# Altium project ZYNQ-HS-DEV.PrjPcb (part 3 of 4)

## Sheet ZHSD-HDMI.SchDoc
size A3; DrawnBy: UGUR KELES; DocumentNumber: 15; SheetNumber: 15; SheetTotal: 17; Size: A3
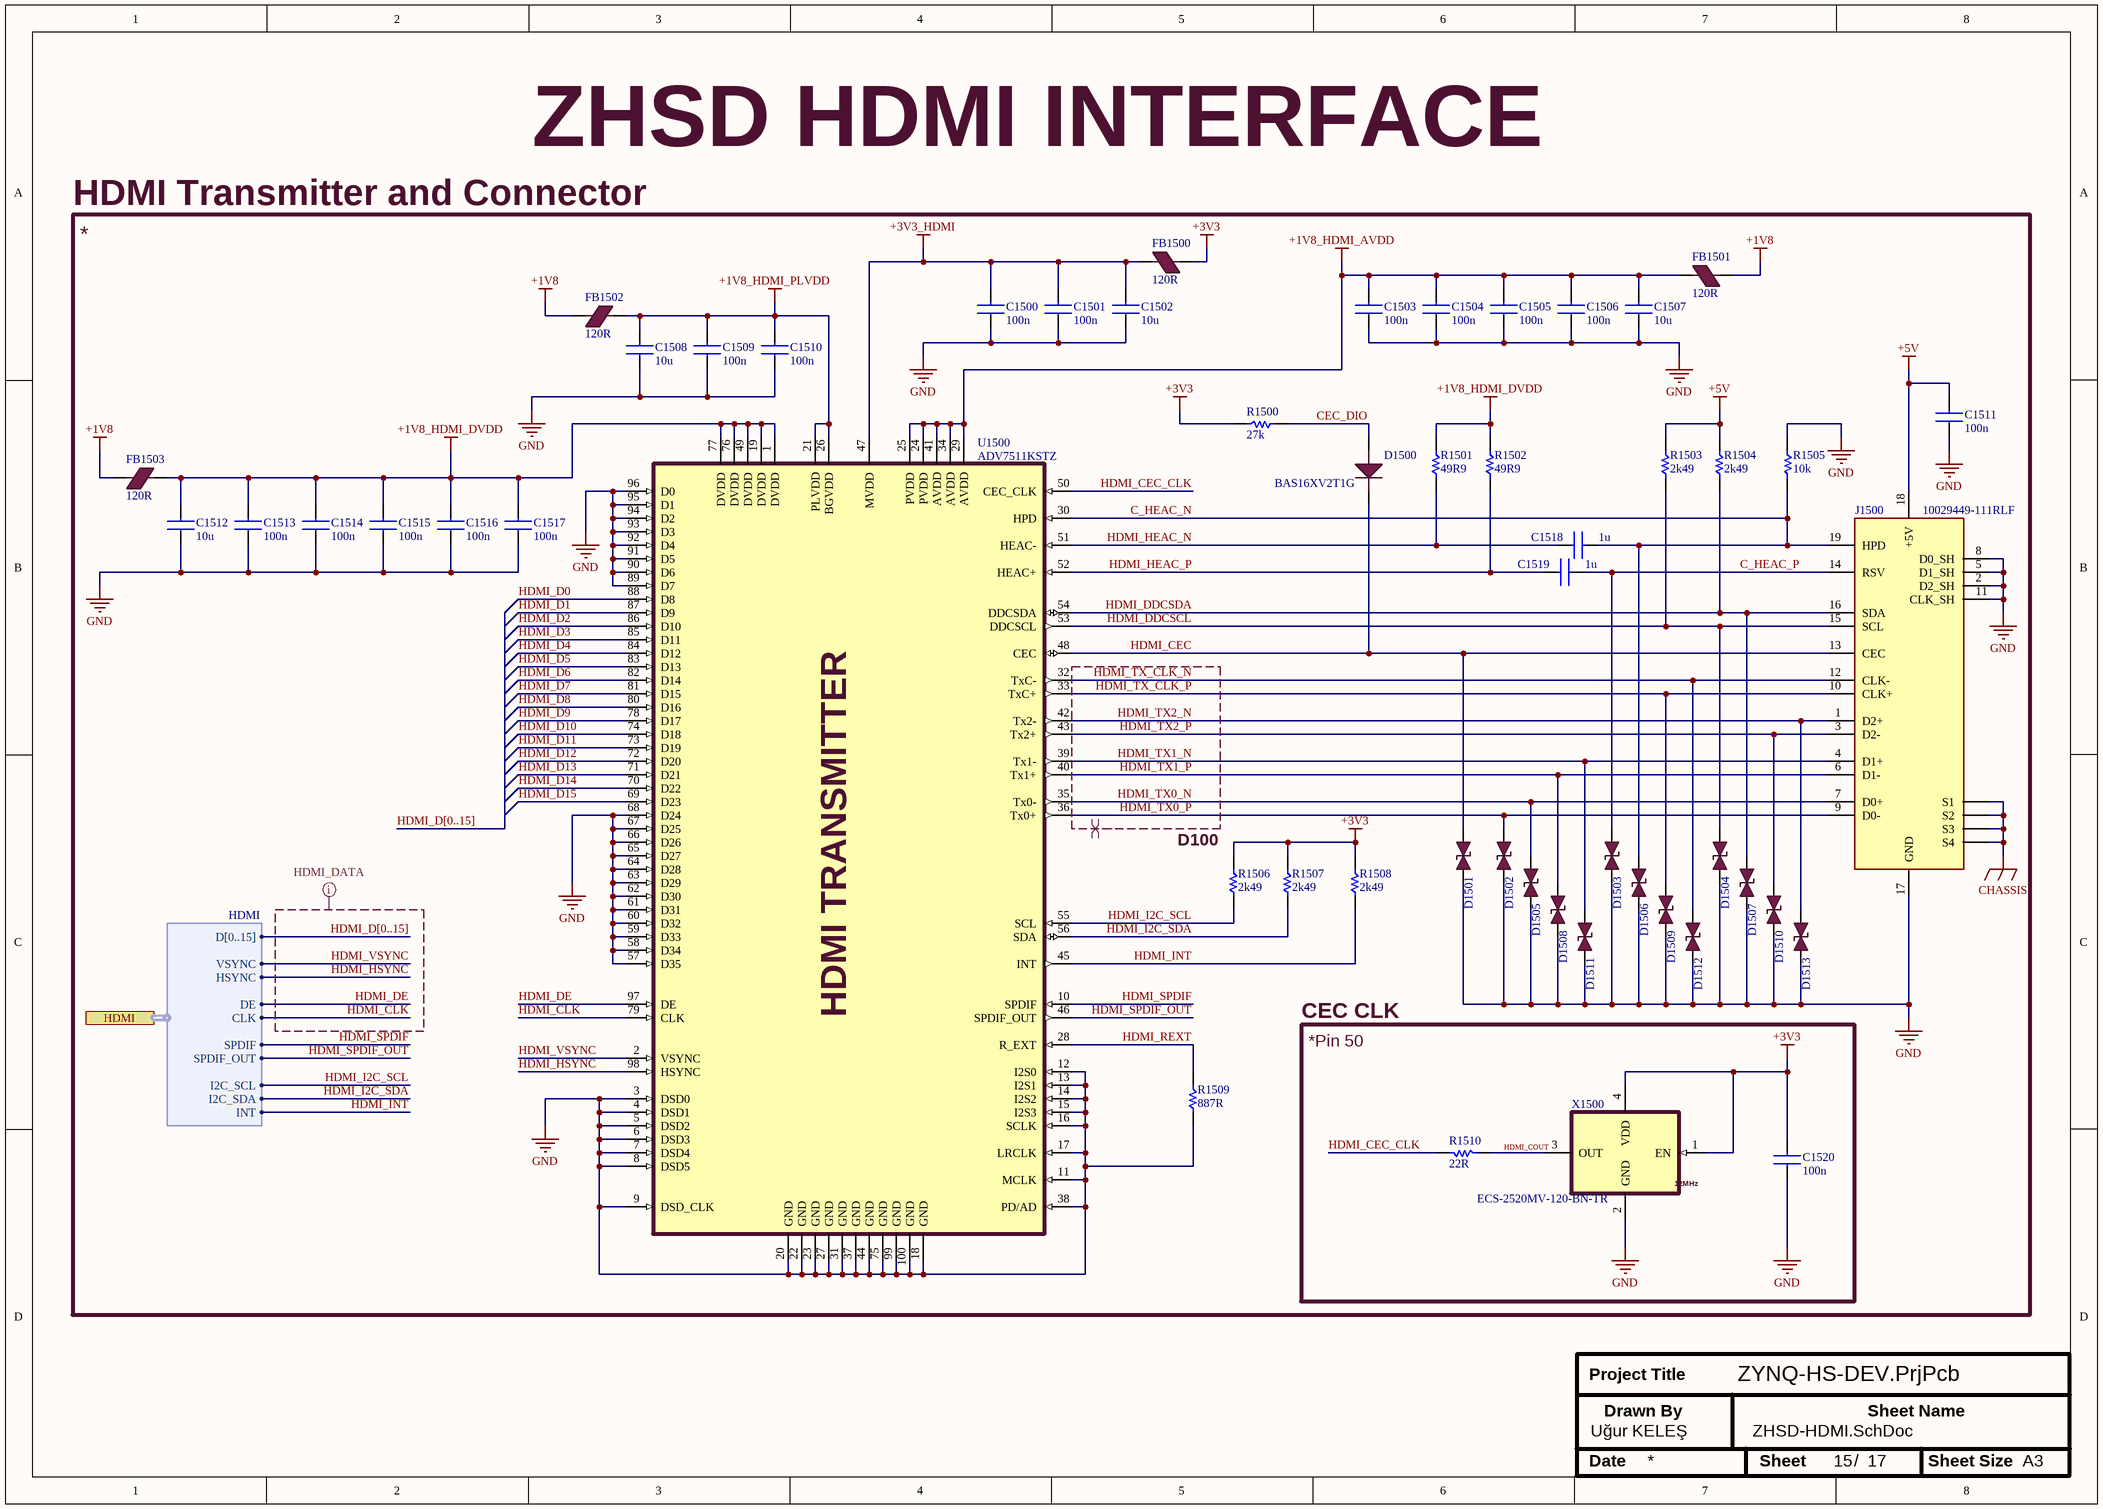
[diagram p11: ZHSD-HDMI.SchDoc]

### Parts
C1500  100n  [0603CAPC1608X09N]
C1501  100n  [0603CAPC1608X09N]
C1502  10u  [0603CAPC1608X09N]
C1503  100n  [0603CAPC1608X09N]
C1504  100n  [0603CAPC1608X09N]
C1505  100n  [0603CAPC1608X09N]
C1506  100n  [0603CAPC1608X09N]
C1507  10u  [0603CAPC1608X09N]
C1508  10u  [0603CAPC1608X09N]
C1509  100n  [0603CAPC1608X09N]
C1510  100n  [0603CAPC1608X09N]
C1511  100n  [0603CAPC1608X09N]
C1512  10u  [0603CAPC1608X09N]
C1513  100n  [0603CAPC1608X09N]
C1514  100n  [0603CAPC1608X09N]
C1515  100n  [0603CAPC1608X09N]
C1516  100n  [0603CAPC1608X09N]
C1517  100n  [0603CAPC1608X09N]
C1518  1u  [0603CAPC1608X09N]
C1519  1u  [0603CAPC1608X09N]
C1520  100n  [0603CAPC1608X09N]
D1500  BAS16XV2T1G  [SODFL160X50-2N]
D1501  B72590D0050H160  [0402DIOC1005X06N]  (value not drawn)
D1502  B72590D0050H160  [0402DIOC1005X06N]  (value not drawn)
D1503  B72590D0050H160  [0402DIOC1005X06N]  (value not drawn)
D1504  B72590D0050H160  [0402DIOC1005X06N]  (value not drawn)
D1505  B72590D0050H160  [0402DIOC1005X06N]  (value not drawn)
D1506  B72590D0050H160  [0402DIOC1005X06N]  (value not drawn)
D1507  B72590D0050H160  [0402DIOC1005X06N]  (value not drawn)
D1508  B72590D0050H160  [0402DIOC1005X06N]  (value not drawn)
D1509  B72590D0050H160  [0402DIOC1005X06N]  (value not drawn)
D1510  B72590D0050H160  [0402DIOC1005X06N]  (value not drawn)
D1511  B72590D0050H160  [0402DIOC1005X06N]  (value not drawn)
D1512  B72590D0050H160  [0402DIOC1005X06N]  (value not drawn)
D1513  B72590D0050H160  [0402DIOC1005X06N]  (value not drawn)
FB1500  120R  [0603INDC1608X08N]
FB1501  120R  [0603INDC1608X08N]
FB1502  120R  [0603INDC1608X08N]
FB1503  120R  [0603INDC1608X08N]
J1500  10029449-111RLF  [AMPHENOL_10029449-111RLF]
R1500  27k  [0402RESC1005X04N]
R1501  49R9  [0402RESC1005X04N]
R1502  49R9  [0402RESC1005X04N]
R1503  2k49  [0402RESC1005X04N]
R1504  2k49  [0402RESC1005X04N]
R1505  10k  [0603RESC1608X05N]
R1506  2k49  [0402RESC1005X04N]
R1507  2k49  [0402RESC1005X04N]
R1508  2k49  [0402RESC1005X04N]
R1509  887R  [0603RESC1608X05N]
R1510  22R  [0603RESC1608X05N]
U1500  ADV7511KSTZ  [LQFP50P1600X1600X160-100N]
X1500  ECS-2520MV-120-BN-TR  [XTAL_2520]

### Blocks framed on the sheet
HDMI Transmitter and Connector: C1500-C1519 D1500-D1513 FB1500-FB1503 J1500 R1500-R1509 U1500
CEC CLK: C1520 R1510 X1500

### Ports
HDMI (harness HDMI, see ZHSD-Block[4000,1700], ZHSD-ZYNQ-PL[3900,2700])

### Harnesses
HDMI: SPDIF, SPDIF_OUT, VSYNC, HSYNC, DE, CLK, INT, I2C_SCL, I2C_SDA, D[0..15]

### Nets
+1V8: FB1501.1 FB1502.1 FB1503.1
+1V8_HDMI_AVDD: C1503.2 C1504.2 C1505.2 C1506.2 C1507.2 FB1501.2 U1500.24(PVDD) U1500.25(PVDD) U1500.29(AVDD) U1500.34(AVDD) U1500.41(AVDD)
+1V8_HDMI_DVDD: C1512.2 C1513.2 C1514.2 C1515.2 C1516.2 C1517.2 FB1503.2 R1501.2 R1502.2 U1500.1(DVDD) U1500.19(DVDD) U1500.49(DVDD) U1500.76(DVDD) U1500.77(DVDD)
+1V8_HDMI_PLVDD: C1508.2 C1509.2 C1510.2 FB1502.2 U1500.21(PLVDD) U1500.26(BGVDD)
+3V3: C1520.2 FB1500.1 R1500.2 R1506.2 R1507.2 R1508.2 X1500.1(EN) X1500.4(VDD)
+3V3_HDMI: C1500.2 C1501.2 C1502.2 FB1500.2 U1500.47(MVDD)
+5V: C1511.2 J1500.18(+5V) R1503.2 R1504.2
CHASSIS: J1500.S1 J1500.S2 J1500.S3 J1500.S4
GND: C1500.1 C1501.1 C1502.1 C1503.1 C1504.1 C1505.1 C1506.1 C1507.1 C1508.1 C1509.1 C1510.1 C1511.1 C1512.1 C1513.1 C1514.1 C1515.1 C1516.1 C1517.1 C1520.1 D1501.1 D1502.1 D1503.1 D1504.1 D1505.1 D1506.1 D1507.1 D1508.1 D1509.1 D1510.1 D1511.1 D1512.1 D1513.1 J1500.2(D2_SH) J1500.5(D1_SH) J1500.8(D0_SH) J1500.11(CLK_SH) J1500.17(GND) R1505.1 R1509.1 U1500.3(DSD0) U1500.4(DSD1) U1500.5(DSD2) U1500.6(DSD3) U1500.7(DSD4) U1500.8(DSD5) U1500.9(DSD_CLK) U1500.11(MCLK) U1500.12(I2S0) U1500.13(I2S1) U1500.14(I2S2) U1500.15(I2S3) U1500.16(SCLK) U1500.17(LRCLK) U1500.18(GND) U1500.20(GND) U1500.22(GND) U1500.23(GND) U1500.27(GND) U1500.31(GND) U1500.37(GND) U1500.38(PD/AD) U1500.44(GND) U1500.57(D35) U1500.58(D34) U1500.59(D33) U1500.60(D32) U1500.61(D31) U1500.62(D30) U1500.63(D29) U1500.64(D28) U1500.65(D27) U1500.66(D26) U1500.67(D25) U1500.68(D24) U1500.75(GND) U1500.89(D7) U1500.90(D6) U1500.91(D5) U1500.92(D4) U1500.93(D3) U1500.94(D2) U1500.95(D1) U1500.96(D0) U1500.99(GND) U1500.100(GND) X1500.2(GND)
C_HEAC_N: C1518.2 D1506.2 J1500.19(HPD) R1505.2 U1500.30(HPD)
C_HEAC_P: C1519.2 D1503.2 J1500.14(RSV)
CEC_DIO: D1500.A R1500.1
HDMI_CEC: D1500.C D1501.2 J1500.13(CEC) U1500.48(CEC)
HDMI_CEC_CLK: R1510.1 U1500.50(CEC_CLK)
HDMI_CLK: U1500.79(CLK) ; port HDMI.CLK
HDMI_COUT: R1510.2 X1500.3(OUT)
HDMI_D0: U1500.88(D8)
HDMI_D1: U1500.87(D9)
HDMI_D2: U1500.86(D10)
HDMI_D3: U1500.85(D11)
HDMI_D4: U1500.84(D12)
HDMI_D5: U1500.83(D13)
HDMI_D6: U1500.82(D14)
HDMI_D7: U1500.81(D15)
HDMI_D8: U1500.80(D16)
HDMI_D9: U1500.78(D17)
HDMI_D10: U1500.74(D18)
HDMI_D11: U1500.73(D19)
HDMI_D12: U1500.72(D20)
HDMI_D13: U1500.71(D21)
HDMI_D14: U1500.70(D22)
HDMI_D15: U1500.69(D23)
HDMI_DDCSCL: D1504.2 J1500.15(SCL) R1503.1 U1500.53(DDCSCL)
HDMI_DDCSDA: D1507.2 J1500.16(SDA) R1504.1 U1500.54(DDCSDA)
HDMI_DE: U1500.97(DE) ; port HDMI.DE
HDMI_HEAC_N: C1518.1 R1501.1 U1500.51(HEAC-)
HDMI_HEAC_P: C1519.1 R1502.1 U1500.52(HEAC+)
HDMI_HSYNC: U1500.98(HSYNC) ; port HDMI.HSYNC
HDMI_I2C_SCL: R1506.1 U1500.55(SCL) ; port HDMI.I2C_SCL
HDMI_I2C_SDA: R1507.1 U1500.56(SDA) ; port HDMI.I2C_SDA
HDMI_INT: R1508.1 U1500.45(INT) ; port HDMI.INT
HDMI_REXT: R1509.2 U1500.28(R_EXT)
HDMI_SPDIF: U1500.10(SPDIF) ; port HDMI.SPDIF
HDMI_SPDIF_OUT: U1500.46(SPDIF_OUT) ; port HDMI.SPDIF_OUT
HDMI_TX0_N: D1505.2 J1500.7(D0+) U1500.35(Tx0-)
HDMI_TX0_P: D1502.2 J1500.9(D0-) U1500.36(Tx0+)
HDMI_TX1_N: D1511.2 J1500.4(D1+) U1500.39(Tx1-)
HDMI_TX1_P: D1508.2 J1500.6(D1-) U1500.40(Tx1+)
HDMI_TX2_N: D1513.2 J1500.1(D2+) U1500.42(Tx2-)
HDMI_TX2_P: D1510.2 J1500.3(D2-) U1500.43(Tx2+)
HDMI_TX_CLK_N: D1512.2 J1500.12(CLK-) U1500.32(TxC-)
HDMI_TX_CLK_P: D1509.2 J1500.10(CLK+) U1500.33(TxC+)
HDMI_VSYNC: U1500.2(VSYNC) ; port HDMI.VSYNC

### Buses and harness runs
bus HDMI_D[0..15]

### Layout directives
differential pair; differential pair class HDMI_DIFF; rule Differential Pairs Routing [Pref Gap = 10mil    Min Gap  = 5mil    Max Gap  = 10milPref Width = 3.937mil    Min Width  = 3.543mil    Max Width  = 3.937mil]: HDMI_TX0_N, HDMI_TX0_P, HDMI_TX1_N, HDMI_TX1_P, HDMI_TX2_N, HDMI_TX2_P, HDMI_TX_CLK_N, HDMI_TX_CLK_P
net class HDMI_DATA; rule Matched Net Lengths [Delay Tolerance = 10ps]: HDMI_CLK, HDMI_D[0..15], HDMI_DE, HDMI_HSYNC, HDMI_VSYNC

### Notes on the sheet
- ZHSD HDMI INTERFACE
- *
- (near R1506) D100
- *Pin 50
- Project Title
- Uğur KELEŞ
- Drawn By
- Sheet Name
- Date
- Sheet
- /
- Sheet Size
- A3
- (in symbol ADV7511KSTZ) HDMI TRANSMITTER
- (in symbol ECS-2520MV-120-BN-TR) 12MHz

### Library data of the parts
C1500 C1501 C1503-C1506 C1509-C1511 C1513-C1517 = GRM155R71C104KA88J: CAP CER 0.1UF 16V X7R 0402 (1005) ±10%; Manufacturer: Murata Electronics; Value: 0.1 µF; ComponentLink1Description: Datasheet; ComponentLink1URL: https://search.murata.co.jp/Ceramy/image/img/A01X/G101/ENG/GRM155R71C104KA88-01.pdf; MPN: GRM155R71C104KA88J; Package: 0402; Tolerance: ±10%; Voltage: 16V
C1502 C1507 C1508 C1512 = GRM188Z71A106MA73D: CAP CER 10UF 10V X7R 0603 (1608) ±20%; Manufacturer: Murata Electronics; Value: 10 µF; ComponentLink1Description: Datasheet; ComponentLink1URL: https://search.murata.co.jp/Ceramy/image/img/A01X/G101/ENG/GRM188Z71A106MA73-01A.pdf; MPN: GRM188Z71A106MA73D; Package: 0603; Tolerance: ±20%; Voltage: 10V
C1518 C1519 = GRM188R61E105KA12D: CAP CER 1UF 25V X5R 0603 (1608) ±10%; Manufacturer: Murata Power Solutions Inc.; Value: 1 µF; ComponentLink1Description: Datasheet; ComponentLink1URL: https://search.murata.co.jp/Ceramy/image/img/A01X/G101/ENG/GRM188R61E105KA12-01.pdf; MPN: GRM188R61E105KA12D; Package: 0603; Tolerance: ±10%; Voltage: 25V
C1520 = C0603C104K5RACTU: CAP CER 0.1UF 50V X7R 0603 (1608) ±10%; Manufacturer: KEMET; Value: 0.1 µF; ComponentLink1Description: Datasheet; ComponentLink1URL: https://yageogroup.com/content/datasheet/asset/file/KEM_C1002_X7R_SMD; MPN: C0603C104K5RACTU; Package: 0603; Tolerance: ±10%; Voltage: 50V
D1500 = BAS16XV2T1G: DIODE STANDARD 100V 200MA SOD523; Manufacturer: onsemi; ComponentLink1Description: Datasheet; ComponentLink1URL: https://www.onsemi.com/pdf/datasheet/bas16xv2t1-d.pdf; MPN: BAS16XV2T1G; Package: SOD-523
D1501-D1513 = B72590D0050H160: Varistor 1 Circuit Surface Mount, MLCV 0402 (1005 Metric); Manufacturer: EPCOS - TDK Electronics; ComponentLink1Description: Datasheet; ComponentLink1URL: https://www.tdk-electronics.tdk.com/inf/75/ds/High_speed_series.pdf?ref_disty=digikey; MPN: B72590D0050H160; Package: 0402
FB1500-FB1503 = BLM18SG121TN1D: FERRITE BEAD 120 OHM 0603 (1608) 3A 25mOhm; Manufacturer: Murata Electronics; Impedance @ Frequency: 120 Ohms @ 100 MHz; ComponentLink1Description: Datasheet; ComponentLink1URL: https://pim.murata.com/asset/pim4/ferriteBeadInductortypefilter/ENFA0003_PDF_FERRITEBEADINDUCTORTYPEFILTER?lastModifiedDatetime=20250707190934; ComponentLink2Description: Website; ComponentLink2URL: https://pim.murata.com/en-global/pim/details/?partNum=BLM18SG121TN1%23; Current Rating (Max): 3A; DC Resistance (DCR) (Max): 25mOhm; MPN: BLM18SG121TN1D; Package: 0603
J1500 = 10029449-111RLF: CONN RCPT 1.4 HDMI 19POS SMD R/A; Manufacturer: Amphenol ICC (FCI); ComponentLink1Description: Datasheet; ComponentLink1URL: https://cdn.amphenol-cs.com/media/wysiwyg/files/documentation/datasheet/inputoutput/io_hdmi_receptacles.pdf; ComponentLink2Description: Drawing; ComponentLink2URL: https://cdn.amphenol-cs.com/media/wysiwyg/files/drawing/10029449.pdf; ComponentLink3Description: Product Specification; ComponentLink3URL: https://cdn.amphenol-cs.com/media/wysiwyg/files/documentation/gs-12-309.pdf; MPN: 10029449-111RLF
R1500 = RC0402FR-0727KL: RES 27K OHM 1% 1/16W 0402 (1005); Manufacturer: YAGEO; Value: 27 kOhms; Voltage: 50V; ComponentLink1Description: Datasheet; ComponentLink1URL: https://yageogroup.com/content/datasheet/asset/file/PYU-RC_GROUP_51_ROHS_L; MPN: RC0402FR-0727KL; Tolerance: ±1%; Package: 0402
R1501 R1502 = RC0402FR-0749R9L: RES 49.9 OHM 1% 1/16W 0402 (1005); Manufacturer: YAGEO; Value: 49.9 Ohms; Voltage: 50V; ComponentLink1Description: Datasheet; ComponentLink1URL: https://yageogroup.com/content/datasheet/asset/file/PYU-RC_GROUP_51_ROHS_L; MPN: RC0402FR-0749R9L; Tolerance: ±1%; Package: 0402
R1503 R1504 R1506-R1508 = RC0402FR-132K49L: RES 2.49K OHM 1% 1/16W 0402 (1005); Manufacturer: YAGEO; Value: 2.49 kOhms; Voltage: 50V; ComponentLink1Description: Datasheet; ComponentLink1URL: https://yageogroup.com/content/datasheet/asset/file/PYU-RC_GROUP_51_ROHS_L; MPN: RC0402FR-132K49L; Tolerance: ±1%; Package: 0402
R1505 = RC0603FR-0710KL: as R1403-R1406 on sheet ZHSD-ZYNQ-PL; ComponentLink1Description: Datasheet; ComponentLink1URL: https://yageogroup.com/content/datasheet/asset/file/PYU-RC_GROUP_51_ROHS_L; MPN: RC0603FR-0710KL; Tolerance: ±1%; Package: 0603
R1509 = RC0603FR-07887RL: RES 887 OHM 1% 1/10W 0603 (1608); Manufacturer: YAGEO; Value: 887 Ohms; Voltage: 75V; ComponentLink1Description: Datasheet; ComponentLink1URL: https://yageogroup.com/content/datasheet/asset/file/PYU-RC_GROUP_51_ROHS_L; MPN: RC0603FR-07887RL; Tolerance: ±1%; Package: 0603
R1510 = RC0603FR-0722RL: RES 22 OHM 1% 1/10W 0603 (1608); Manufacturer: YAGEO; Value: 22 Ohms; Voltage: 75V; ComponentLink1Description: Datasheet; ComponentLink1URL: https://yageogroup.com/content/datasheet/asset/file/PYU-RC_GROUP_51_ROHS_L; MPN: RC0603FR-0722RL; Tolerance: ±1%; Package: 0603
U1500 = ADV7511KSTZ: 225 MHz, High Performance HDMI® Transmitter with ARC; Manufacturer: Analog Devices Inc./Maxim Integrated; ComponentLink1Description: Datasheet; ComponentLink1URL: https://www.analog.com/media/en/technical-documentation/data-sheets/ADV7511.pdf; ComponentLink2Description: Hardware User's Guide; ComponentLink2URL: https://www.analog.com/media/en/technical-documentation/user-guides/ADV7511_Hardware_Users_Guide.pdf; ComponentLink3Description: HDMI-Enabled Designs Using the ADV7511; ComponentLink3URL: https://www.analog.com/media/en/technical-documentation/evaluation-documentation/hdmi-enabled_designs_using_adv7511.pdf; ComponentLink4Description: Design Support Files; ComponentLink4URL: https://ez.analog.com/video/w/documents/794/adv7511-design-support-files; MPN: ADV7511KSTZ
X1500 = ECS-2520MV-120-BN-TR: XTAL OSC XO 12.0000MHZ CMOS SMD; Manufacturer: ECS Inc.; ComponentLink1Description: Datasheet; ComponentLink1URL: https://ecsxtal.com/store/pdf/ECS-2520MV.pdf; MPN: ECS-2520MV-120-BN-TR

## Sheet ZHSD-MIPI-CSI2.SchDoc
size A4; DocumentNumber: 16; SheetNumber: 16; SheetTotal: 17; Size: A4
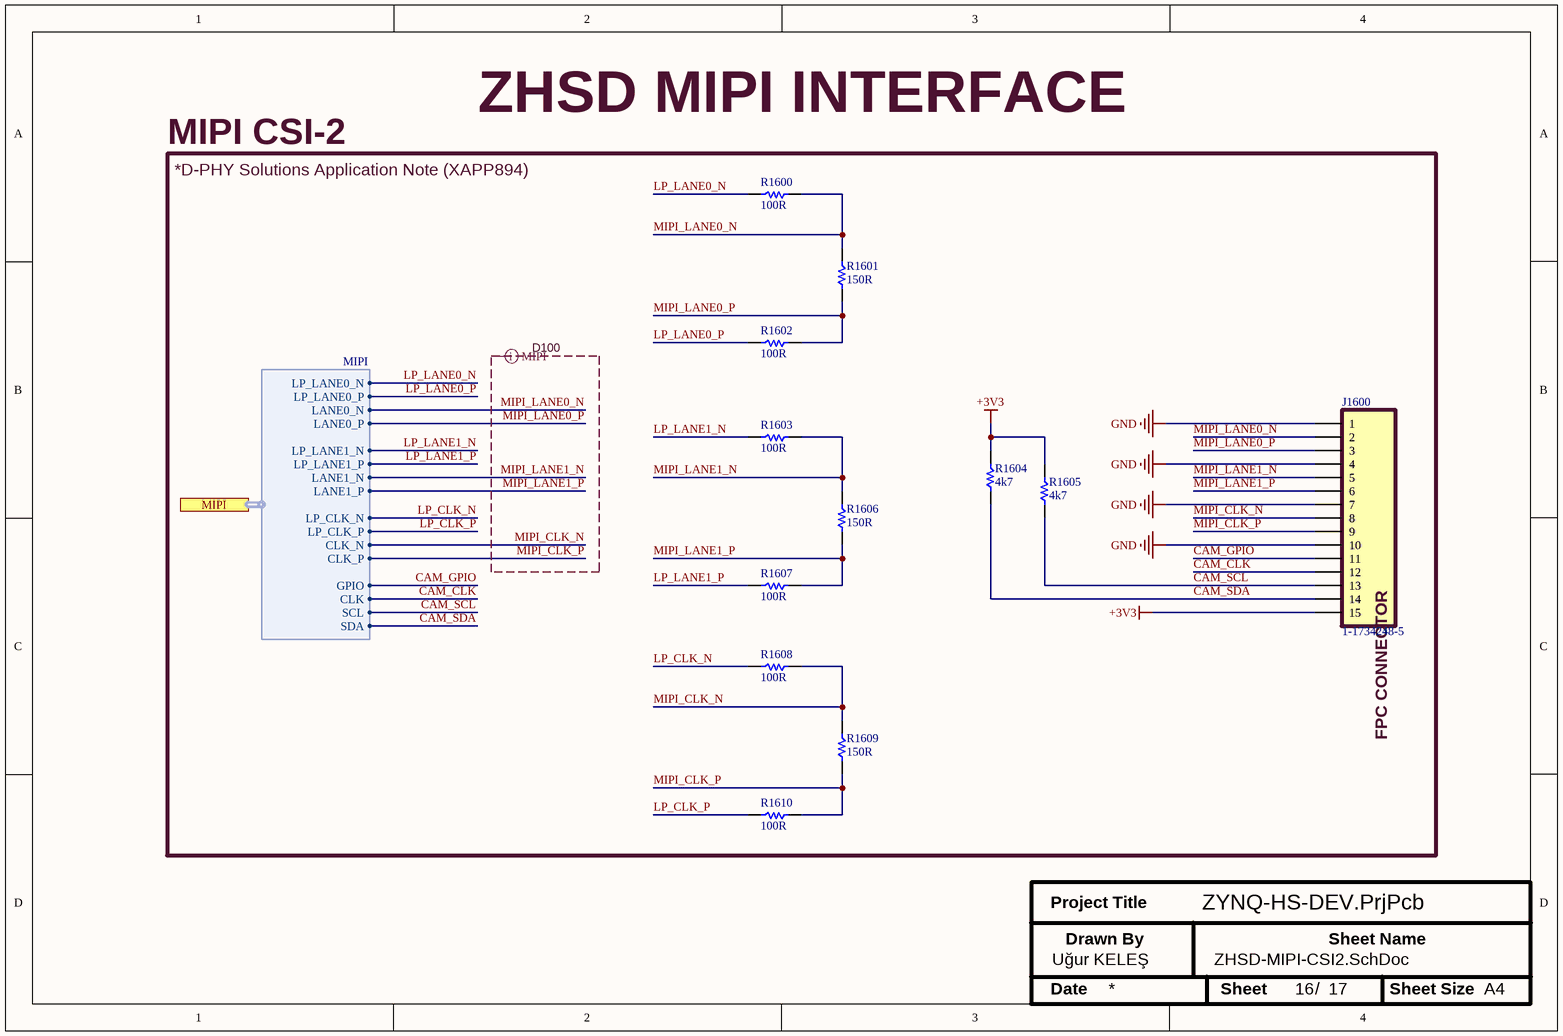
[diagram p12: ZHSD-MIPI-CSI2.SchDoc]

### Parts
J1600  1-1734248-5  [TE_1-1734248-5]
R1600  100R  [0402RESC1005X04N]
R1601  150R  [0402RESC1005X04N]
R1602  100R  [0402RESC1005X04N]
R1603  100R  [0402RESC1005X04N]
R1604  4k7  [0402RESC1005X04N]
R1605  4k7  [0402RESC1005X04N]
R1606  150R  [0402RESC1005X04N]
R1607  100R  [0402RESC1005X04N]
R1608  100R  [0402RESC1005X04N]
R1609  150R  [0402RESC1005X04N]
R1610  100R  [0402RESC1005X04N]

### Ports
MIPI (harness MIPI, see ZHSD-Block[3600,1100], ZHSD-ZYNQ-PL[600,2200])

### Harnesses
MIPI: LANE0_N, LANE0_P, LANE1_N, LANE1_P, CLK_N, CLK_P, GPIO, CLK, SCL, SDA, LP_LANE0_N, LP_LANE0_P, LP_LANE1_N, LP_LANE1_P, LP_CLK_N, LP_CLK_P

### Nets
+3V3: J1600.15 R1604.2 R1605.2
GND: J1600.1 J1600.4 J1600.7 J1600.10
CAM_CLK: J1600.12 ; port MIPI.CLK
CAM_GPIO: J1600.11 ; port MIPI.GPIO
CAM_SCL: J1600.13 R1605.1 ; port MIPI.SCL
CAM_SDA: J1600.14 R1604.1 ; port MIPI.SDA
LP_CLK_N: R1608.2 ; port MIPI.LP_CLK_N
LP_CLK_P: R1610.2 ; port MIPI.LP_CLK_P
LP_LANE0_N: R1600.2 ; port MIPI.LP_LANE0_N
LP_LANE0_P: R1602.2 ; port MIPI.LP_LANE0_P
LP_LANE1_N: R1603.2 ; port MIPI.LP_LANE1_N
LP_LANE1_P: R1607.2 ; port MIPI.LP_LANE1_P
MIPI_CLK_N: J1600.8 R1608.1 R1609.2 ; port MIPI.CLK_N
MIPI_CLK_P: J1600.9 R1609.1 R1610.1 ; port MIPI.CLK_P
MIPI_LANE0_N: J1600.2 R1600.1 R1601.2 ; port MIPI.LANE0_N
MIPI_LANE0_P: J1600.3 R1601.1 R1602.1 ; port MIPI.LANE0_P
MIPI_LANE1_N: J1600.5 R1603.1 R1606.2 ; port MIPI.LANE1_N
MIPI_LANE1_P: J1600.6 R1606.1 R1607.1 ; port MIPI.LANE1_P

### Layout directives
differential pair; differential pair class MIPI; rule Differential Pairs Routing [Pref Gap = 10mil    Min Gap  = 5mil    Max Gap  = 10milPref Width = 3.937mil    Min Width  = 3.543mil    Max Width  = 3.937mil]; Impedance: D100: MIPI_CLK_N, MIPI_CLK_P, MIPI_LANE0_N, MIPI_LANE0_P, MIPI_LANE1_N, MIPI_LANE1_P

### Notes on the sheet
- MIPI CSI-2
- *D-PHY Solutions Application Note (XAPP894)
- ZHSD MIPI INTERFACE
- Project Title
- Uğur KELEŞ
- Drawn By
- Sheet Name
- Date
- Sheet
- /
- Sheet Size
- A4
- (in symbol 1-1734248-5) FPC CONNECTOR

### Library data of the parts
J1600 = 1-1734248-5: CONN FPC VERT 15POS 1MM SMD; pin to pad: 1>1+1_1 2>2+2_1 3>3+3_1 4>4+4_1 5>5+5_1 6>6+6_1 7>7+7_1 8>8+8_1 9>9+9_1 10>10+10_1 11>11+11_1 12>12+12_1 13>13+13_1 14>14+14_1 15>15+15_1; Manufacturer: TE Connectivity AMP Connectors; ComponentLink2Description: Drawing; ComponentLink2URL: https://www.te.com/commerce/DocumentDelivery/DDEController?Action=srchrtrv&DocNm=1734248&DocType=Customer%20Drawing&DocLang=English&DocFormat=pdf&PartCntxt=1-1734248-5; ComponentLink3Description: Product Specification; ComponentLink3URL: https://www.te.com/commerce/DocumentDelivery/DDEController?Action=srchrtrv&DocNm=108-57080&DocType=Specification%20Or%20Standard&DocLang=English&DocFormat=pdf&PartCntxt=1-1734248-5; MPN: 1-1734248-5
R1600 R1602 R1603 R1607 R1608 R1610 = RC0402FR-07100RL: RES 100 OHM 1% 1/16W 0402 (1005); Manufacturer: YAGEO; Value: 100 Ohms; Voltage: 50V; ComponentLink1Description: Datasheet; ComponentLink1URL: https://yageogroup.com/content/datasheet/asset/file/PYU-RC_GROUP_51_ROHS_L; MPN: RC0402FR-07100RL; Tolerance: ±1%; Package: 0402
R1601 R1606 R1609 = RC0402FR-07150RL: RES 150 OHM 1% 1/16W 0402 (1005); Manufacturer: YAGEO; Value: 150 Ohms; Voltage: 50V; ComponentLink1Description: Datasheet; ComponentLink1URL: https://yageogroup.com/content/datasheet/asset/file/PYU-RC_GROUP_51_ROHS_L; MPN: RC0402FR-07150RL; Tolerance: ±1%; Package: 0402
R1604 R1605 = RC0402JR-074K7L: RES 4.7K OHM 5% 1/16W 0402 (1005); Manufacturer: YAGEO; MPN: RT0402FRE0780RL; Value: 4.7 kOhms; Voltage: 50V; ComponentLink1Description: Datasheet; ComponentLink1URL: https://yageogroup.com/content/datasheet/asset/file/PYU-RC_GROUP_51_ROHS_L; Tolerance: ±5%; Package: 0402

## Sheet ZHSD-ZYNQ-DDR.SchDoc
size A3; DocumentNumber: 6; SheetNumber: 6; SheetTotal: 17; Size: A3
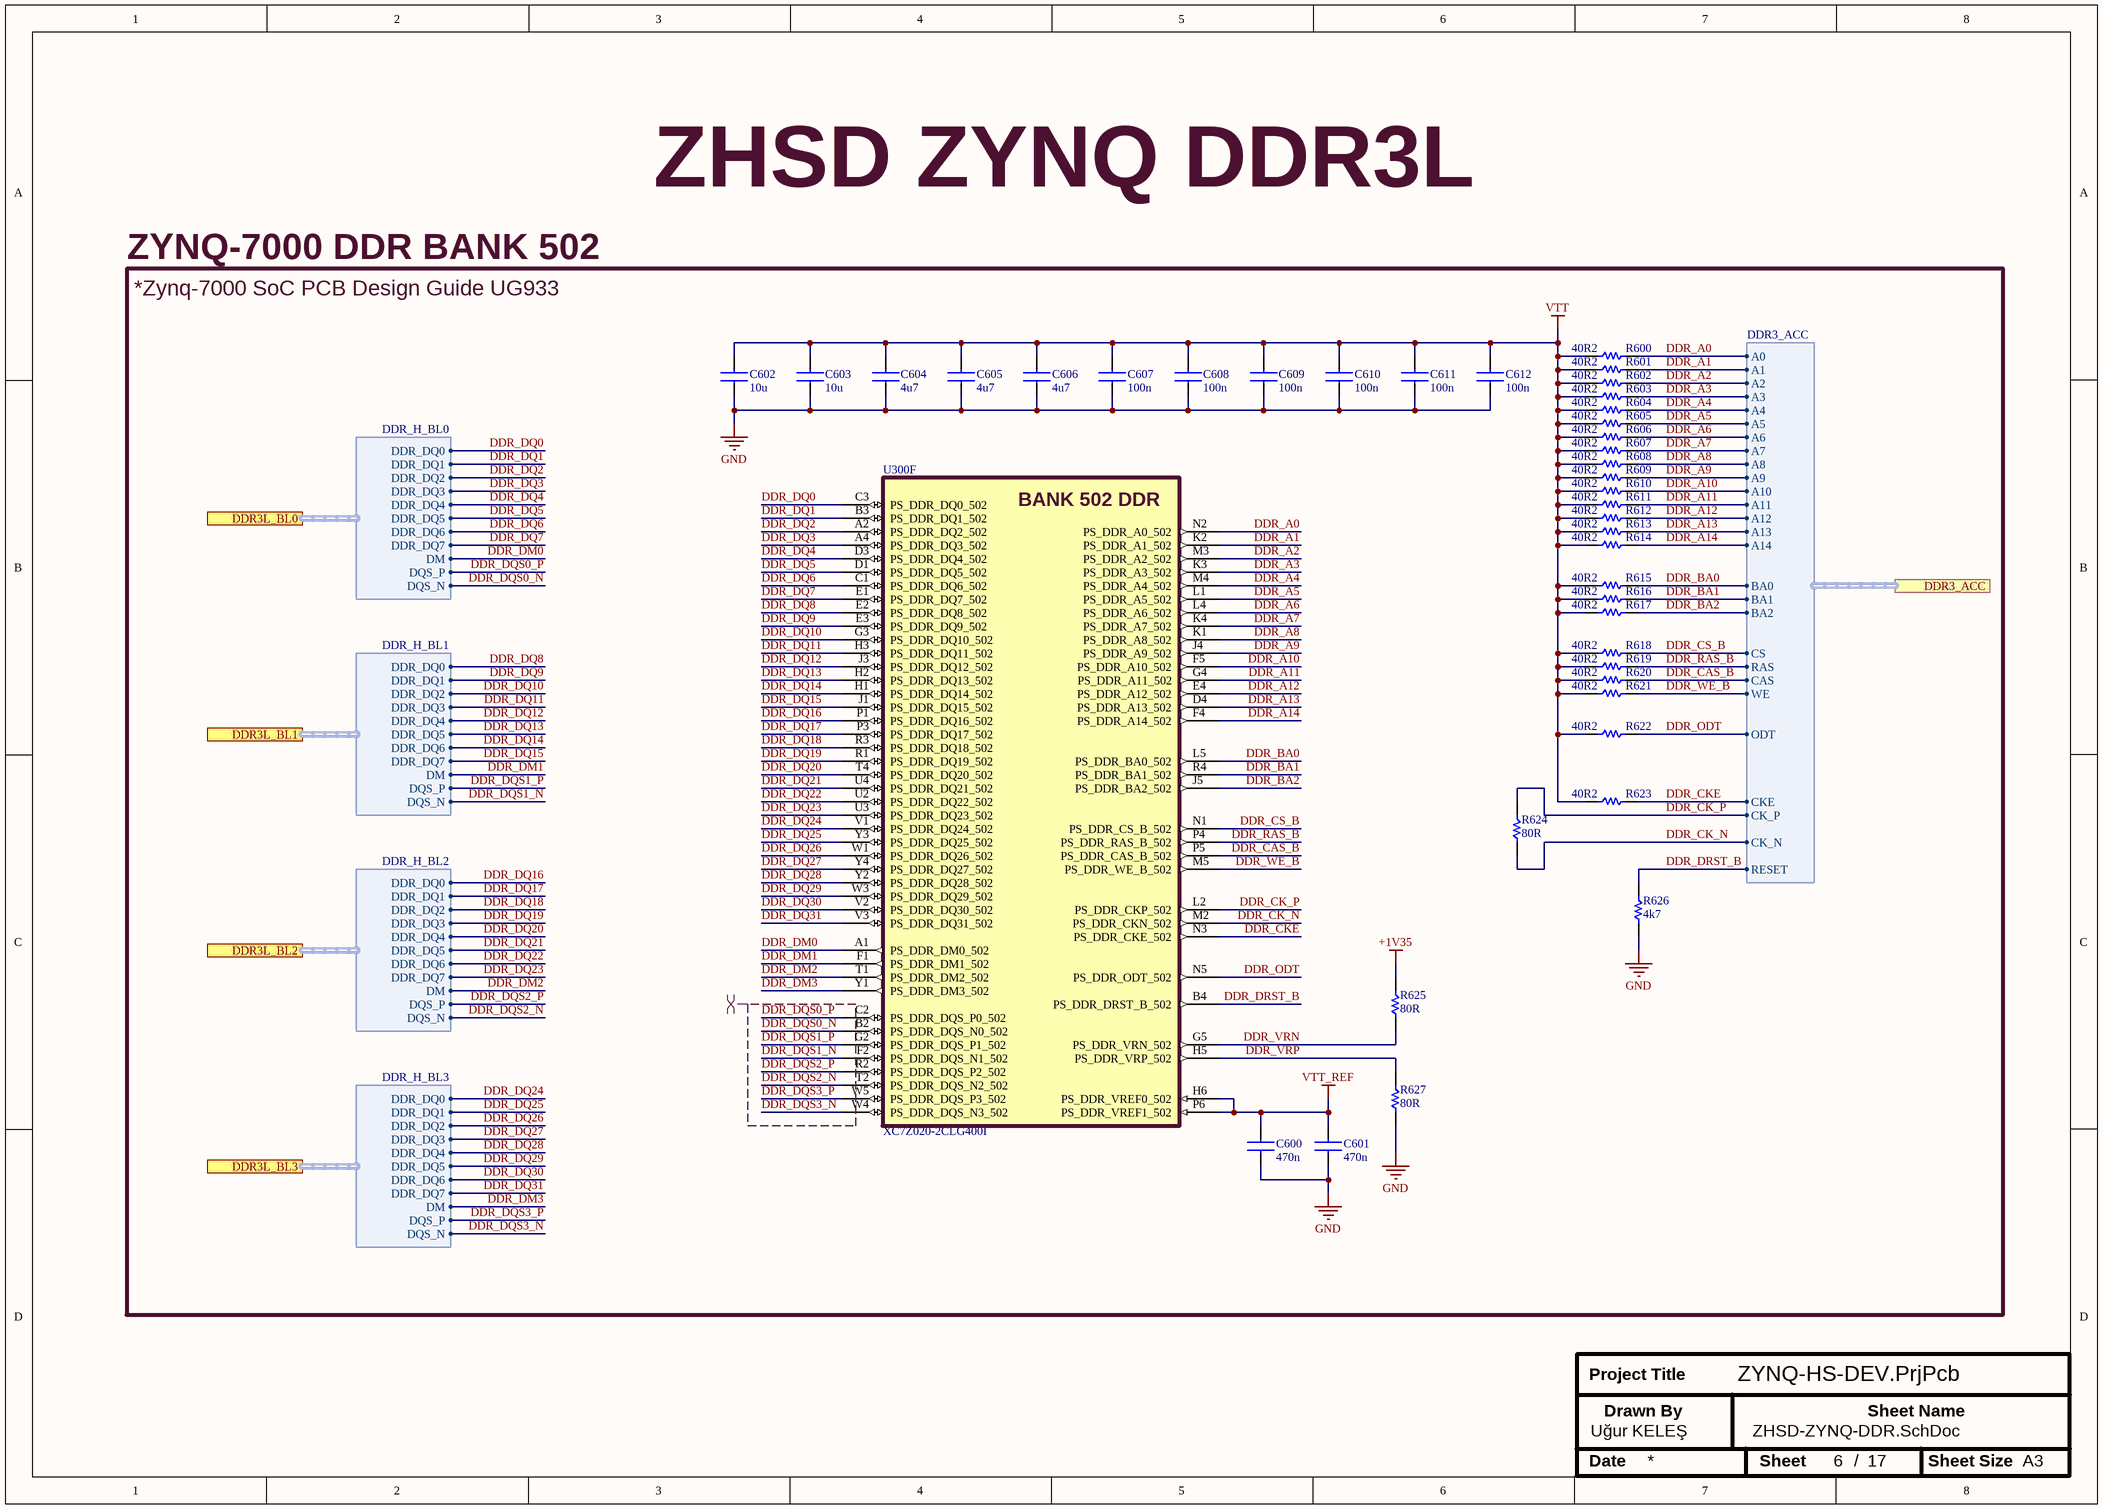
[diagram p13: ZHSD-ZYNQ-DDR.SchDoc]

### Parts
C600  470n  [0402CAPC1005X06N]
C601  470n  [0402CAPC1005X06N]
C602  10u  [0603CAPC1608X09N]
C603  10u  [0603CAPC1608X09N]
C604  4u7  [0603CAPC1608X09N]
C605  4u7  [0603CAPC1608X09N]
C606  4u7  [0603CAPC1608X09N]
C607  100n  [0603CAPC1608X09N]
C608  100n  [0603CAPC1608X09N]
C609  100n  [0603CAPC1608X09N]
C610  100n  [0603CAPC1608X09N]
C611  100n  [0603CAPC1608X09N]
C612  100n  [0603CAPC1608X09N]
R600  40R2  [0402RESC1005X04N]
R601  40R2  [0402RESC1005X04N]
R602  40R2  [0402RESC1005X04N]
R603  40R2  [0402RESC1005X04N]
R604  40R2  [0402RESC1005X04N]
R605  40R2  [0402RESC1005X04N]
R606  40R2  [0402RESC1005X04N]
R607  40R2  [0402RESC1005X04N]
R608  40R2  [0402RESC1005X04N]
R609  40R2  [0402RESC1005X04N]
R610  40R2  [0402RESC1005X04N]
R611  40R2  [0402RESC1005X04N]
R612  40R2  [0402RESC1005X04N]
R613  40R2  [0402RESC1005X04N]
R614  40R2  [0402RESC1005X04N]
R615  40R2  [0402RESC1005X04N]
R616  40R2  [0402RESC1005X04N]
R617  40R2  [0402RESC1005X04N]
R618  40R2  [0402RESC1005X04N]
R619  40R2  [0402RESC1005X04N]
R620  40R2  [0402RESC1005X04N]
R621  40R2  [0402RESC1005X04N]
R622  40R2  [0402RESC1005X04N]
R623  40R2  [0402RESC1005X04N]
R624  80R  [0402RESC1005X04N]
R625  80R  [0402RESC1005X04N]
R626  4k7  [0402RESC1005X04N]
R627  80R  [0402RESC1005X04N]
U300  XC7Z020-2CLG400I  [BGA400C80P20X20_1700X1700X147]  (part F of 8)

### Ports
DDR3_ACC (harness DDR3_ACC, see ZHSD-Block[7500,5000], ZHSD-DDR3L[800,7700]), DDR3L_BL0 (harness DDR_H_BL0, see ZHSD-Block[7500,5900], ZHSD-DDR3L[11900,8400]), DDR3L_BL1 (harness DDR_H_BL1, see ZHSD-Block[7500,5700], ZHSD-DDR3L[11900,6500]), DDR3L_BL2 (harness DDR_H_BL2, see ZHSD-Block[7500,5500], ZHSD-DDR3L[14300,8400]), DDR3L_BL3 (harness DDR_H_BL3, see ZHSD-Block[7500,5300], ZHSD-DDR3L[14300,6500])

### Harnesses
DDR_H_BL0: DDR_DQ0, DDR_DQ1, DDR_DQ2, DDR_DQ3, DDR_DQ4, DDR_DQ5, DDR_DQ6, DDR_DQ7, DM, DQS_P, DQS_N
DDR3_ACC: A0, A1, A2, A3, A4, A5, A6, A7, A8, A9, A10, A11, A12, A13, BA0, BA1, CK_P, CK_N, CKE, WE, CAS, RAS, CS, ODT, RESET, BA2, A14
DDR_H_BL1: DDR_DQ0, DDR_DQ1, DDR_DQ2, DDR_DQ3, DDR_DQ4, DDR_DQ5, DDR_DQ6, DDR_DQ7, DM, DQS_P, DQS_N
DDR_H_BL2: DDR_DQ0, DDR_DQ1, DDR_DQ2, DDR_DQ3, DDR_DQ4, DDR_DQ5, DDR_DQ6, DDR_DQ7, DM, DQS_P, DQS_N
DDR_H_BL3: DDR_DQ0, DDR_DQ1, DDR_DQ2, DDR_DQ3, DDR_DQ4, DDR_DQ5, DDR_DQ6, DDR_DQ7, DM, DQS_P, DQS_N

### Nets
+1V35: R625.2
GND: C600.1 C601.1 C602.1 C603.1 C604.1 C605.1 C606.1 C607.1 C608.1 C609.1 C610.1 C611.1 C612.1 R626.1 R627.1
VTT: C602.2 C603.2 C604.2 C605.2 C606.2 C607.2 C608.2 C609.2 C610.2 C611.2 C612.2 R600.1 R601.1 R602.1 R603.1 R604.1 R605.1 R606.1 R607.1 R608.1 R609.1 R610.1 R611.1 R612.1 R613.1 R614.1 R615.1 R616.1 R617.1 R618.1 R619.1 R620.1 R621.1 R622.1 R623.1
VTT_REF: C600.2 C601.2 U300.H6(PS_DDR_VREF0_502) U300.P6(PS_DDR_VREF1_502)
DDR_A0: R600.2 U300.N2(PS_DDR_A0_502) ; port DDR3_ACC.A0
DDR_A1: R601.2 U300.K2(PS_DDR_A1_502) ; port DDR3_ACC.A1
DDR_A2: R602.2 U300.M3(PS_DDR_A2_502) ; port DDR3_ACC.A2
DDR_A3: R603.2 U300.K3(PS_DDR_A3_502) ; port DDR3_ACC.A3
DDR_A4: R604.2 U300.M4(PS_DDR_A4_502) ; port DDR3_ACC.A4
DDR_A5: R605.2 U300.L1(PS_DDR_A5_502) ; port DDR3_ACC.A5
DDR_A6: R606.2 U300.L4(PS_DDR_A6_502) ; port DDR3_ACC.A6
DDR_A7: R607.2 U300.K4(PS_DDR_A7_502) ; port DDR3_ACC.A7
DDR_A8: R608.2 U300.K1(PS_DDR_A8_502) ; port DDR3_ACC.A8
DDR_A9: R609.2 U300.J4(PS_DDR_A9_502) ; port DDR3_ACC.A9
DDR_A10: R610.2 U300.F5(PS_DDR_A10_502) ; port DDR3_ACC.A10
DDR_A11: R611.2 U300.G4(PS_DDR_A11_502) ; port DDR3_ACC.A11
DDR_A12: R612.2 U300.E4(PS_DDR_A12_502) ; port DDR3_ACC.A12
DDR_A13: R613.2 U300.D4(PS_DDR_A13_502) ; port DDR3_ACC.A13
DDR_A14: R614.2 U300.F4(PS_DDR_A14_502) ; port DDR3_ACC.A14
DDR_BA0: R615.2 U300.L5(PS_DDR_BA0_502) ; port DDR3_ACC.BA0
DDR_BA1: R616.2 U300.R4(PS_DDR_BA1_502) ; port DDR3_ACC.BA1
DDR_BA2: R617.2 U300.J5(PS_DDR_BA2_502) ; port DDR3_ACC.BA2
DDR_CAS_B: R620.2 U300.P5(PS_DDR_CAS_B_502) ; port DDR3_ACC.CAS
DDR_CK_N: R624.1 U300.M2(PS_DDR_CKN_502) ; port DDR3_ACC.CK_N
DDR_CK_P: R624.2 U300.L2(PS_DDR_CKP_502) ; port DDR3_ACC.CK_P
DDR_CKE: R623.2 U300.N3(PS_DDR_CKE_502) ; port DDR3_ACC.CKE
DDR_CS_B: R618.2 U300.N1(PS_DDR_CS_B_502) ; port DDR3_ACC.CS
DDR_DM0: U300.A1(PS_DDR_DM0_502) ; port DDR3L_BL0.DM
DDR_DM1: U300.F1(PS_DDR_DM1_502) ; port DDR3L_BL1.DM
DDR_DM2: U300.T1(PS_DDR_DM2_502) ; port DDR3L_BL2.DM
DDR_DM3: U300.Y1(PS_DDR_DM3_502) ; port DDR3L_BL3.DM
DDR_DQ0: U300.C3(PS_DDR_DQ0_502) ; port DDR3L_BL0.DDR_DQ0
DDR_DQ1: U300.B3(PS_DDR_DQ1_502) ; port DDR3L_BL0.DDR_DQ1
DDR_DQ2: U300.A2(PS_DDR_DQ2_502) ; port DDR3L_BL0.DDR_DQ2
DDR_DQ3: U300.A4(PS_DDR_DQ3_502) ; port DDR3L_BL0.DDR_DQ3
DDR_DQ4: U300.D3(PS_DDR_DQ4_502) ; port DDR3L_BL0.DDR_DQ4
DDR_DQ5: U300.D1(PS_DDR_DQ5_502) ; port DDR3L_BL0.DDR_DQ5
DDR_DQ6: U300.C1(PS_DDR_DQ6_502) ; port DDR3L_BL0.DDR_DQ6
DDR_DQ7: U300.E1(PS_DDR_DQ7_502) ; port DDR3L_BL0.DDR_DQ7
DDR_DQ8: U300.E2(PS_DDR_DQ8_502) ; port DDR3L_BL1.DDR_DQ0
DDR_DQ9: U300.E3(PS_DDR_DQ9_502) ; port DDR3L_BL1.DDR_DQ1
DDR_DQ10: U300.G3(PS_DDR_DQ10_502) ; port DDR3L_BL1.DDR_DQ2
DDR_DQ11: U300.H3(PS_DDR_DQ11_502) ; port DDR3L_BL1.DDR_DQ3
DDR_DQ12: U300.J3(PS_DDR_DQ12_502) ; port DDR3L_BL1.DDR_DQ4
DDR_DQ13: U300.H2(PS_DDR_DQ13_502) ; port DDR3L_BL1.DDR_DQ5
DDR_DQ14: U300.H1(PS_DDR_DQ14_502) ; port DDR3L_BL1.DDR_DQ6
DDR_DQ15: U300.J1(PS_DDR_DQ15_502) ; port DDR3L_BL1.DDR_DQ7
DDR_DQ16: U300.P1(PS_DDR_DQ16_502) ; port DDR3L_BL2.DDR_DQ0
DDR_DQ17: U300.P3(PS_DDR_DQ17_502) ; port DDR3L_BL2.DDR_DQ1
DDR_DQ18: U300.R3(PS_DDR_DQ18_502) ; port DDR3L_BL2.DDR_DQ2
DDR_DQ19: U300.R1(PS_DDR_DQ19_502) ; port DDR3L_BL2.DDR_DQ3
DDR_DQ20: U300.T4(PS_DDR_DQ20_502) ; port DDR3L_BL2.DDR_DQ4
DDR_DQ21: U300.U4(PS_DDR_DQ21_502) ; port DDR3L_BL2.DDR_DQ5
DDR_DQ22: U300.U2(PS_DDR_DQ22_502) ; port DDR3L_BL2.DDR_DQ6
DDR_DQ23: U300.U3(PS_DDR_DQ23_502) ; port DDR3L_BL2.DDR_DQ7
DDR_DQ24: U300.V1(PS_DDR_DQ24_502) ; port DDR3L_BL3.DDR_DQ0
DDR_DQ25: U300.Y3(PS_DDR_DQ25_502) ; port DDR3L_BL3.DDR_DQ1
DDR_DQ26: U300.W1(PS_DDR_DQ26_502) ; port DDR3L_BL3.DDR_DQ2
DDR_DQ27: U300.Y4(PS_DDR_DQ27_502) ; port DDR3L_BL3.DDR_DQ3
DDR_DQ28: U300.Y2(PS_DDR_DQ28_502) ; port DDR3L_BL3.DDR_DQ4
DDR_DQ29: U300.W3(PS_DDR_DQ29_502) ; port DDR3L_BL3.DDR_DQ5
DDR_DQ30: U300.V2(PS_DDR_DQ30_502) ; port DDR3L_BL3.DDR_DQ6
DDR_DQ31: U300.V3(PS_DDR_DQ31_502) ; port DDR3L_BL3.DDR_DQ7
DDR_DQS0_N: U300.B2(PS_DDR_DQS_N0_502) ; port DDR3L_BL0.DQS_N
DDR_DQS0_P: U300.C2(PS_DDR_DQS_P0_502) ; port DDR3L_BL0.DQS_P
DDR_DQS1_N: U300.F2(PS_DDR_DQS_N1_502) ; port DDR3L_BL1.DQS_N
DDR_DQS1_P: U300.G2(PS_DDR_DQS_P1_502) ; port DDR3L_BL1.DQS_P
DDR_DQS2_N: U300.T2(PS_DDR_DQS_N2_502) ; port DDR3L_BL2.DQS_N
DDR_DQS2_P: U300.R2(PS_DDR_DQS_P2_502) ; port DDR3L_BL2.DQS_P
DDR_DQS3_N: U300.W4(PS_DDR_DQS_N3_502) ; port DDR3L_BL3.DQS_N
DDR_DQS3_P: U300.W5(PS_DDR_DQS_P3_502) ; port DDR3L_BL3.DQS_P
DDR_DRST_B: R626.2 U300.B4(PS_DDR_DRST_B_502) ; port DDR3_ACC.RESET
DDR_ODT: R622.2 U300.N5(PS_DDR_ODT_502) ; port DDR3_ACC.ODT
DDR_RAS_B: R619.2 U300.P4(PS_DDR_RAS_B_502) ; port DDR3_ACC.RAS
DDR_VRN: R625.1 U300.G5(PS_DDR_VRN_502)
DDR_VRP: R627.2 U300.H5(PS_DDR_VRP_502)
DDR_WE_B: R621.2 U300.M5(PS_DDR_WE_B_502) ; port DDR3_ACC.WE

### Layout directives
differential pair: DDR_DQS0_N, DDR_DQS0_P, DDR_DQS1_N, DDR_DQS1_P, DDR_DQS2_N, DDR_DQS2_P, DDR_DQS3_N, DDR_DQS3_P

### Notes on the sheet
- ZHSD ZYNQ DDR3L
- ZYNQ-7000 DDR BANK 502
- *Zynq-7000 SoC PCB Design Guide UG933
- Project Title
- Uğur KELEŞ
- Drawn By
- Sheet Name
- Date
- Sheet
- /
- Sheet Size
- A3
- (in symbol XC7Z020-2CLG400I, part F) BANK 502 DDR

### Library data of the parts
C600 C601 = GRM155R60J474KE19D: CAP CER 0.47UF 6.3V X5R 0402(1005) ±10%; Manufacturer: Murata Electronics; Value: 0.47 µF; ComponentLink1Description: Datasheet; ComponentLink1URL: https://search.murata.co.jp/Ceramy/image/img/A01X/G101/ENG/GRM21BR71A475KE51-01.pdf; MPN: GRM155R60J474KE19D; Package: 0402; Tolerance: ±10%; Voltage: 6.3V
C602 C603 = GRM188Z71A106MA73D: as C1502 on sheet ZHSD-HDMI; ComponentLink1Description: Datasheet; ComponentLink1URL: https://search.murata.co.jp/Ceramy/image/img/A01X/G101/ENG/GRM188Z71A106MA73-01A.pdf; MPN: GRM188Z71A106MA73D; Package: 0603; Tolerance: ±20%; Voltage: 10V
C604-C606 = CL10A475KP8NNNC: CAP CER 4.7UF 10V X5R 0603 (1608) ±10%; Manufacturer: Samsung Electro-Mechanics; Value: 4.7 µF; ComponentLink1Description: Datasheet; ComponentLink1URL: https://mm.digikey.com/Volume0/opasdata/d220001/medias/docus/609/CL10A475KP8NNNC_Spec.pdf; MPN: CL10A475KP8NNNC; Package: 0603; Tolerance: ±10%; Voltage: 10V
C607-C612 = GRM155R71C104KA88J: as C1500 on sheet ZHSD-HDMI; ComponentLink1Description: Datasheet; ComponentLink1URL: https://search.murata.co.jp/Ceramy/image/img/A01X/G101/ENG/GRM155R71C104KA88-01.pdf; MPN: GRM155R71C104KA88J; Package: 0402; Tolerance: ±10%; Voltage: 16V
R600-R623 = RC0402FR-0740R2L: RES 40.2 OHM 1% 1/16W 0402 (1005); Manufacturer: YAGEO; Value: 40.2 Ohms; Voltage: 50V; ComponentLink1Description: Datasheet; ComponentLink1URL: https://yageogroup.com/content/datasheet/asset/file/PYU-RC_GROUP_51_ROHS_L; MPN: RC0402FR-0740R2L; Tolerance: ±1%; Package: 0402
R624 R625 R627 = RT0402FRE0780RL: RES 80 OHM 1% 1/16W 0402 (1005); Manufacturer: YAGEO; Value: 80 Ohms; Voltage: 50V; ComponentLink1Description: Datasheet; ComponentLink1URL: https://yageogroup.com/content/datasheet/asset/file/PYU-RT_1-TO-0-01_ROHS_L; MPN: RT0402FRE0780RL; Tolerance: ±1%; Package: 0402
R626 = RC0402JR-074K7L: as R1604 on sheet ZHSD-MIPI-CSI2; ComponentLink1Description: Datasheet; ComponentLink1URL: https://yageogroup.com/content/datasheet/asset/file/PYU-RC_GROUP_51_ROHS_L; Tolerance: ±5%; Package: 0402
U300 = XC7Z020-2CLG400I: Dual ARM® Cortex®-A9 MPCore™ with CoreSight™ System On Chip (SOC) IC Zynq®-7000 Artix™-7 FPGA, 85K Logic Cells 766MHz 400-CSPBGA (17x17); Manufacturer: AMD/XILINX; MPN: XC7Z020-2CLG400I; ComponentLink1Description: Datasheet; ComponentLink1URL: https://docs.amd.com/v/u/en-US/ds190-Zynq-7000-Overview; ComponentLink2Description: DC and AC Switching Characteristics; ComponentLink2URL: https://docs.amd.com/v/u/en-US/ds187-XC7Z010-XC7Z020-Data-Sheet; ComponentLink3Description: PCB Design Guide; ComponentLink3URL: https://docs.amd.com/v/u/en-US/ug933-Zynq-7000-PCB; ComponentLink4Description: Packaging and Pinout; ComponentLink4URL: https://docs.amd.com/v/u/en-US/ug865-Zynq-7000-Pkg-Pinout; ComponentLink5Description: Zynq 7000 SoC Technical Reference Manual; ComponentLink5URL: https://docs.amd.com/r/en-US/ug585-zynq-7000-SoC-TRM

## Sheet ZHSD-DDR3L.SchDoc
size A3; DocumentNumber: 7; SheetNumber: 7; SheetTotal: 17; Size: A3
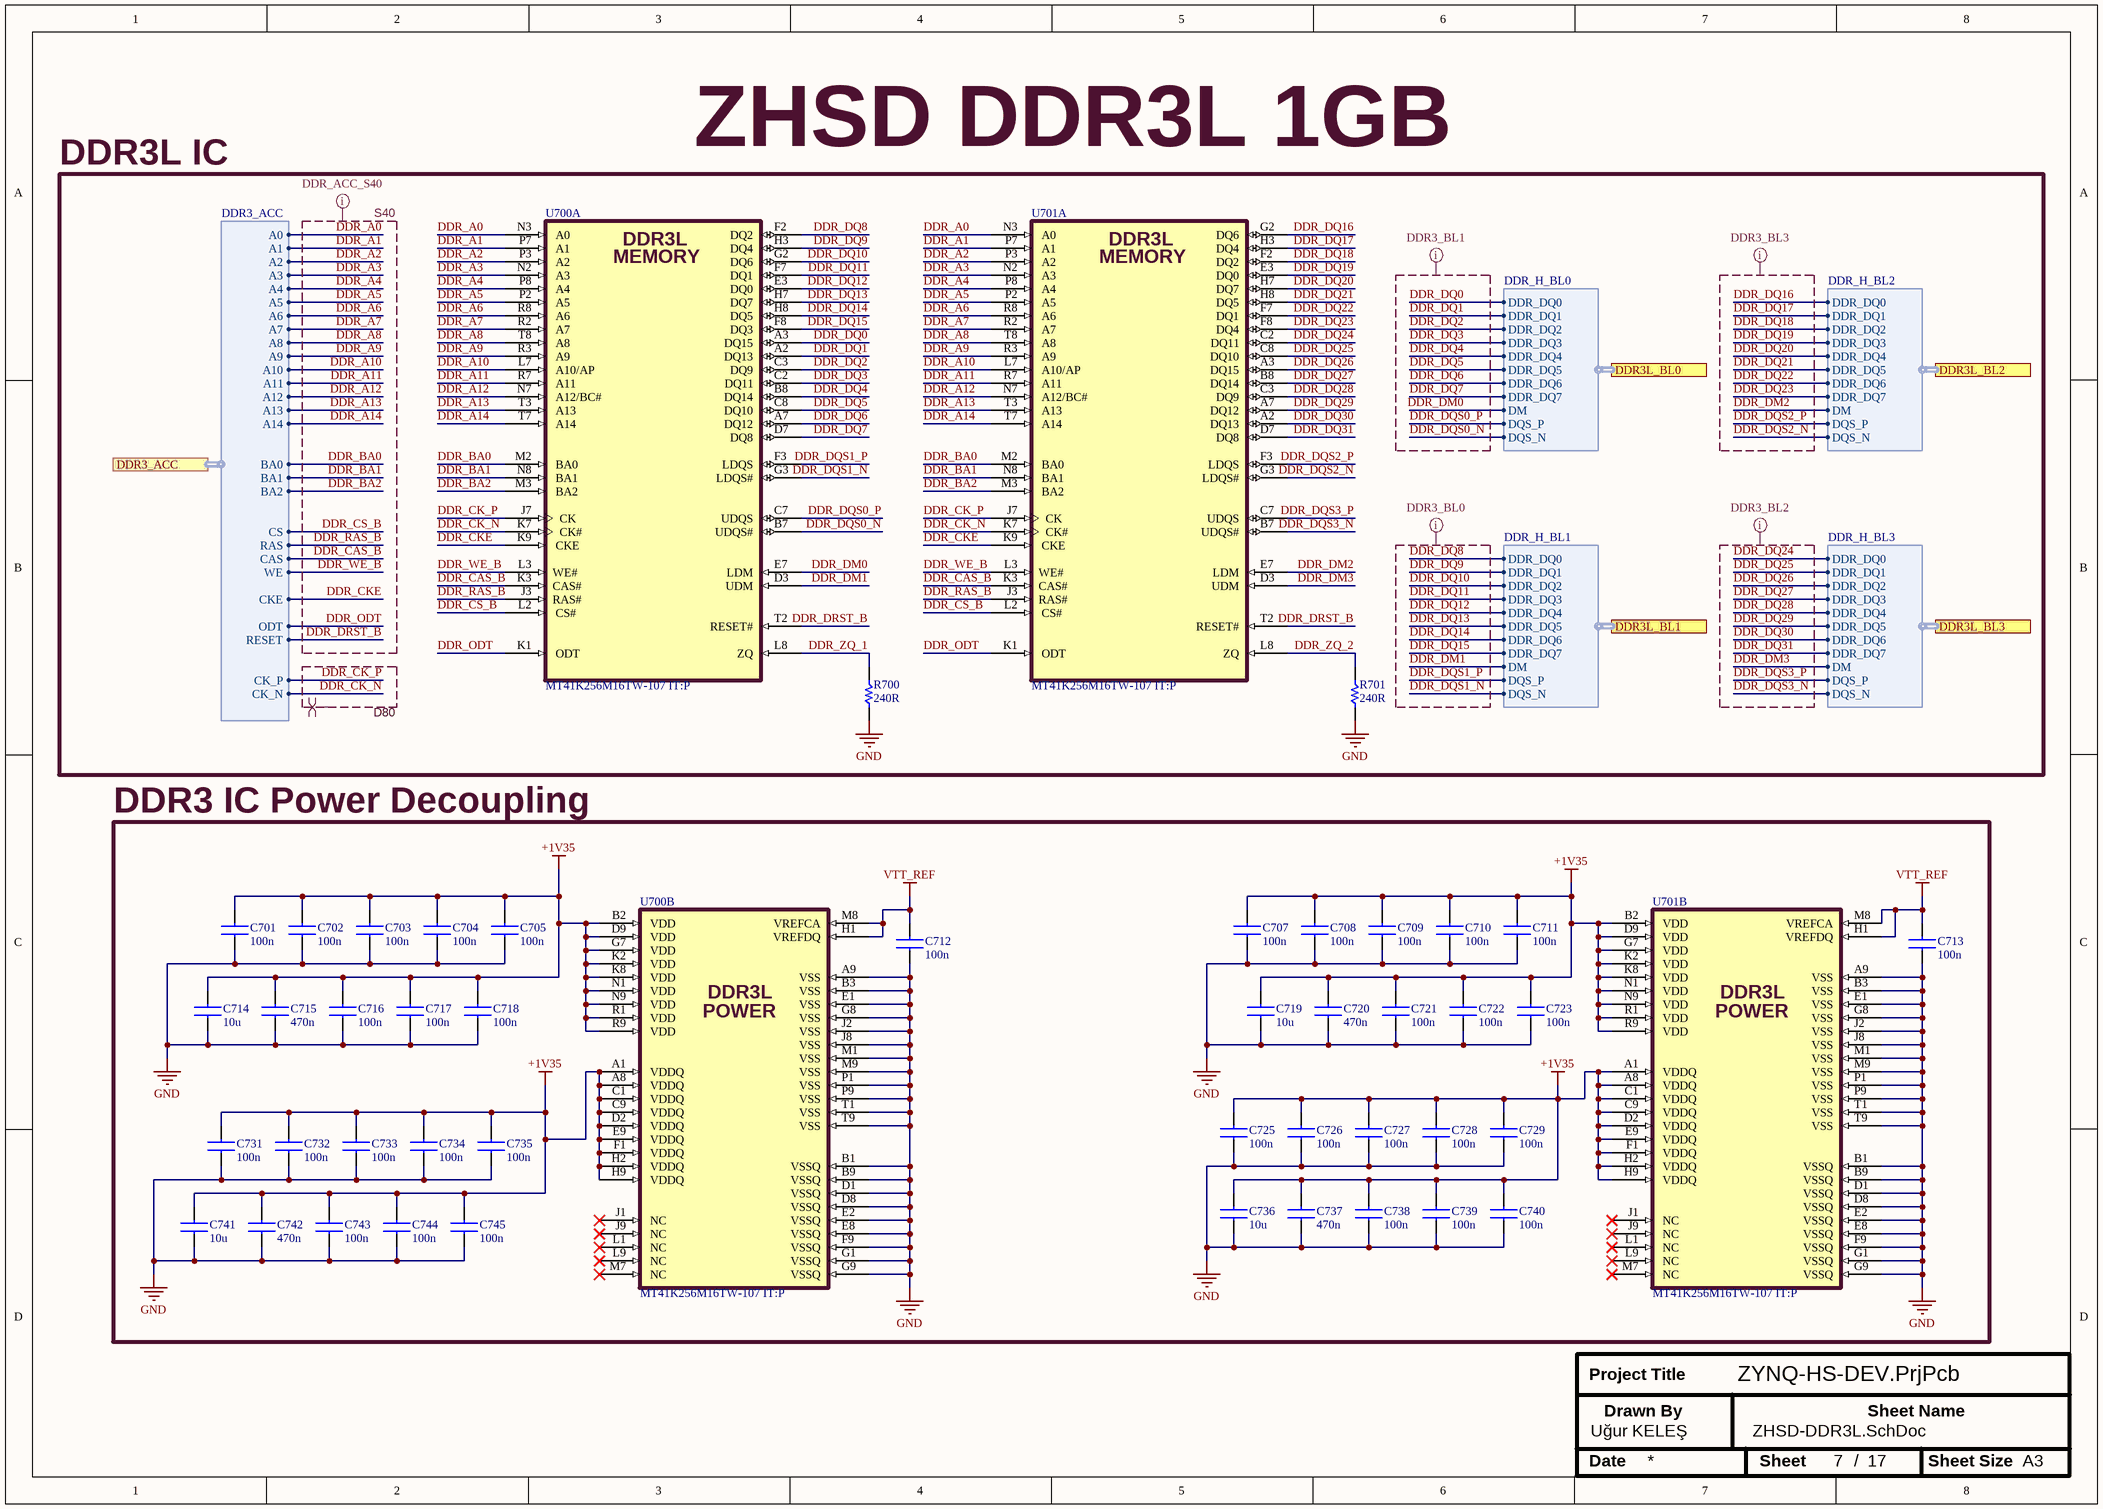
[diagram p14: ZHSD-DDR3L.SchDoc]

### Parts
C701  100n  [0402CAPC1005X06N]
C702  100n  [0402CAPC1005X06N]
C703  100n  [0402CAPC1005X06N]
C704  100n  [0402CAPC1005X06N]
C705  100n  [0402CAPC1005X06N]
C707  100n  [0402CAPC1005X06N]
C708  100n  [0402CAPC1005X06N]
C709  100n  [0402CAPC1005X06N]
C710  100n  [0402CAPC1005X06N]
C711  100n  [0402CAPC1005X06N]
C712  100n  [0402CAPC1005X06N]
C713  100n  [0402CAPC1005X06N]
C714  10u  [0603CAPC1608X09N]
C715  470n  [0402CAPC1005X06N]
C716  100n  [0402CAPC1005X06N]
C717  100n  [0402CAPC1005X06N]
C718  100n  [0402CAPC1005X06N]
C719  10u  [0603CAPC1608X09N]
C720  470n  [0402CAPC1005X06N]
C721  100n  [0402CAPC1005X06N]
C722  100n  [0402CAPC1005X06N]
C723  100n  [0402CAPC1005X06N]
C725  100n  [0402CAPC1005X06N]
C726  100n  [0402CAPC1005X06N]
C727  100n  [0402CAPC1005X06N]
C728  100n  [0402CAPC1005X06N]
C729  100n  [0402CAPC1005X06N]
C731  100n  [0402CAPC1005X06N]
C732  100n  [0402CAPC1005X06N]
C733  100n  [0402CAPC1005X06N]
C734  100n  [0402CAPC1005X06N]
C735  100n  [0402CAPC1005X06N]
C736  10u  [0603CAPC1608X09N]
C737  470n  [0402CAPC1005X06N]
C738  100n  [0402CAPC1005X06N]
C739  100n  [0402CAPC1005X06N]
C740  100n  [0402CAPC1005X06N]
C741  10u  [0603CAPC1608X09N]
C742  470n  [0402CAPC1005X06N]
C743  100n  [0402CAPC1005X06N]
C744  100n  [0402CAPC1005X06N]
C745  100n  [0402CAPC1005X06N]
R700  240R  [0402RESC1005X04N]
R701  240R  [0402RESC1005X04N]
U700  MT41K256M16TW-107 IT:P  [BGA96C80P9X16_900X1400X110]  (parts A,B of 2)
U701  MT41K256M16TW-107 IT:P  [BGA96C80P9X16_900X1400X110]  (parts A,B of 2)

### Blocks framed on the sheet
ZHSD DDR3L 1GB: R700 R701 U700 U701
DDR3 IC Power Decoupling: C701-C705 C707-C723 C725-C729 C731-C745 U700 U701

### Ports
DDR3_ACC (harness DDR3_ACC, see ZHSD-Block[8400,5000], ZHSD-ZYNQ-DDR[14000,6800]), DDR3L_BL0 (harness DDR_H_BL0, see ZHSD-Block[8400,5900], ZHSD-ZYNQ-DDR[1500,7300]), DDR3L_BL1 (harness DDR_H_BL1, see ZHSD-Block[8400,5700], ZHSD-ZYNQ-DDR[1500,5700]), DDR3L_BL2 (harness DDR_H_BL2, see ZHSD-Block[8400,5500], ZHSD-ZYNQ-DDR[1500,4100]), DDR3L_BL3 (harness DDR_H_BL3, see ZHSD-Block[8400,5300], ZHSD-ZYNQ-DDR[1500,2500])

### Harnesses
DDR3_ACC: A0, A1, A2, A3, A4, A5, A6, A7, A8, A9, A10, A11, A12, A13, BA0, BA1, CK_P, CK_N, CKE, WE, CAS, RAS, CS, ODT, RESET, BA2, A14
DDR_H_BL0: DDR_DQ0, DDR_DQ1, DDR_DQ2, DDR_DQ3, DDR_DQ4, DDR_DQ5, DDR_DQ6, DDR_DQ7, DM, DQS_P, DQS_N
DDR_H_BL1: DDR_DQ0, DDR_DQ1, DDR_DQ2, DDR_DQ3, DDR_DQ4, DDR_DQ5, DDR_DQ6, DDR_DQ7, DM, DQS_P, DQS_N
DDR_H_BL2: DDR_DQ0, DDR_DQ1, DDR_DQ2, DDR_DQ3, DDR_DQ4, DDR_DQ5, DDR_DQ6, DDR_DQ7, DM, DQS_P, DQS_N
DDR_H_BL3: DDR_DQ0, DDR_DQ1, DDR_DQ2, DDR_DQ3, DDR_DQ4, DDR_DQ5, DDR_DQ6, DDR_DQ7, DM, DQS_P, DQS_N

### Nets
+1V35: C701.2 C702.2 C703.2 C704.2 C705.2 C707.2 C708.2 C709.2 C710.2 C711.2 C714.2 C715.2 C716.2 C717.2 C718.2 C719.2 C720.2 C721.2 C722.2 C723.2 C725.2 C726.2 C727.2 C728.2 C729.2 C731.2 C732.2 C733.2 C734.2 C735.2 C736.2 C737.2 C738.2 C739.2 C740.2 C741.2 C742.2 C743.2 C744.2 C745.2 U700.A1(VDDQ) U700.A8(VDDQ) U700.B2(VDD) U700.C1(VDDQ) U700.C9(VDDQ) U700.D2(VDDQ) U700.D9(VDD) U700.E9(VDDQ) U700.F1(VDDQ) U700.G7(VDD) U700.H2(VDDQ) U700.H9(VDDQ) U700.K2(VDD) U700.K8(VDD) U700.N1(VDD) U700.N9(VDD) U700.R1(VDD) U700.R9(VDD) U701.A1(VDDQ) U701.A8(VDDQ) U701.B2(VDD) U701.C1(VDDQ) U701.C9(VDDQ) U701.D2(VDDQ) U701.D9(VDD) U701.E9(VDDQ) U701.F1(VDDQ) U701.G7(VDD) U701.H2(VDDQ) U701.H9(VDDQ) U701.K2(VDD) U701.K8(VDD) U701.N1(VDD) U701.N9(VDD) U701.R1(VDD) U701.R9(VDD)
GND: C701.1 C702.1 C703.1 C704.1 C705.1 C707.1 C708.1 C709.1 C710.1 C711.1 C712.1 C713.1 C714.1 C715.1 C716.1 C717.1 C718.1 C719.1 C720.1 C721.1 C722.1 C723.1 C725.1 C726.1 C727.1 C728.1 C729.1 C731.1 C732.1 C733.1 C734.1 C735.1 C736.1 C737.1 C738.1 C739.1 C740.1 C741.1 C742.1 C743.1 C744.1 C745.1 R700.1 R701.1 U700.A9(VSS) U700.B1(VSSQ) U700.B3(VSS) U700.B9(VSSQ) U700.D1(VSSQ) U700.D8(VSSQ) U700.E1(VSS) U700.E2(VSSQ) U700.E8(VSSQ) U700.F9(VSSQ) U700.G1(VSSQ) U700.G8(VSS) U700.G9(VSSQ) U700.J2(VSS) U700.J8(VSS) U700.M1(VSS) U700.M9(VSS) U700.P1(VSS) U700.P9(VSS) U700.T1(VSS) U700.T9(VSS) U701.A9(VSS) U701.B1(VSSQ) U701.B3(VSS) U701.B9(VSSQ) U701.D1(VSSQ) U701.D8(VSSQ) U701.E1(VSS) U701.E2(VSSQ) U701.E8(VSSQ) U701.F9(VSSQ) U701.G1(VSSQ) U701.G8(VSS) U701.G9(VSSQ) U701.J2(VSS) U701.J8(VSS) U701.M1(VSS) U701.M9(VSS) U701.P1(VSS) U701.P9(VSS) U701.T1(VSS) U701.T9(VSS)
VTT_REF: C712.2 C713.2 U700.H1(VREFDQ) U700.M8(VREFCA) U701.H1(VREFDQ) U701.M8(VREFCA)
DDR_A0: U700.N3(A0) U701.N3(A0) ; port DDR3_ACC.A0
DDR_A1: U700.P7(A1) U701.P7(A1) ; port DDR3_ACC.A1
DDR_A2: U700.P3(A2) U701.P3(A2) ; port DDR3_ACC.A2
DDR_A3: U700.N2(A3) U701.N2(A3) ; port DDR3_ACC.A3
DDR_A4: U700.P8(A4) U701.P8(A4) ; port DDR3_ACC.A4
DDR_A5: U700.P2(A5) U701.P2(A5) ; port DDR3_ACC.A5
DDR_A6: U700.R8(A6) U701.R8(A6) ; port DDR3_ACC.A6
DDR_A7: U700.R2(A7) U701.R2(A7) ; port DDR3_ACC.A7
DDR_A8: U700.T8(A8) U701.T8(A8) ; port DDR3_ACC.A8
DDR_A9: U700.R3(A9) U701.R3(A9) ; port DDR3_ACC.A9
DDR_A10: U700.L7(A10/AP) U701.L7(A10/AP) ; port DDR3_ACC.A10
DDR_A11: U700.R7(A11) U701.R7(A11) ; port DDR3_ACC.A11
DDR_A12: U700.N7(A12/BC#) U701.N7(A12/BC#) ; port DDR3_ACC.A12
DDR_A13: U700.T3(A13) U701.T3(A13) ; port DDR3_ACC.A13
DDR_A14: U700.T7(A14) U701.T7(A14) ; port DDR3_ACC.A14
DDR_BA0: U700.M2(BA0) U701.M2(BA0) ; port DDR3_ACC.BA0
DDR_BA1: U700.N8(BA1) U701.N8(BA1) ; port DDR3_ACC.BA1
DDR_BA2: U700.M3(BA2) U701.M3(BA2) ; port DDR3_ACC.BA2
DDR_CAS_B: U700.K3(CAS#) U701.K3(CAS#) ; port DDR3_ACC.CAS
DDR_CK_N: U700.K7(CK#) U701.K7(CK#) ; port DDR3_ACC.CK_N
DDR_CK_P: U700.J7(CK) U701.J7(CK) ; port DDR3_ACC.CK_P
DDR_CKE: U700.K9(CKE) U701.K9(CKE) ; port DDR3_ACC.CKE
DDR_CS_B: U700.L2(CS#) U701.L2(CS#) ; port DDR3_ACC.CS
DDR_DM0: U700.E7(LDM) ; port DDR3L_BL0.DM
DDR_DM1: U700.D3(UDM) ; port DDR3L_BL1.DM
DDR_DM2: U701.E7(LDM) ; port DDR3L_BL2.DM
DDR_DM3: U701.D3(UDM) ; port DDR3L_BL3.DM
DDR_DQ0: U700.A3(DQ15) ; port DDR3L_BL0.DDR_DQ0
DDR_DQ1: U700.A2(DQ13) ; port DDR3L_BL0.DDR_DQ1
DDR_DQ2: U700.C3(DQ9) ; port DDR3L_BL0.DDR_DQ2
DDR_DQ3: U700.C2(DQ11) ; port DDR3L_BL0.DDR_DQ3
DDR_DQ4: U700.B8(DQ14) ; port DDR3L_BL0.DDR_DQ4
DDR_DQ5: U700.C8(DQ10) ; port DDR3L_BL0.DDR_DQ5
DDR_DQ6: U700.A7(DQ12) ; port DDR3L_BL0.DDR_DQ6
DDR_DQ7: U700.D7(DQ8) ; port DDR3L_BL0.DDR_DQ7
DDR_DQ8: U700.F2(DQ2) ; port DDR3L_BL1.DDR_DQ0
DDR_DQ9: U700.H3(DQ4) ; port DDR3L_BL1.DDR_DQ1
DDR_DQ10: U700.G2(DQ6) ; port DDR3L_BL1.DDR_DQ2
DDR_DQ11: U700.F7(DQ1) ; port DDR3L_BL1.DDR_DQ3
DDR_DQ12: U700.E3(DQ0) ; port DDR3L_BL1.DDR_DQ4
DDR_DQ13: U700.H7(DQ7) ; port DDR3L_BL1.DDR_DQ5
DDR_DQ14: U700.H8(DQ5) ; port DDR3L_BL1.DDR_DQ6
DDR_DQ15: U700.F8(DQ3) ; port DDR3L_BL1.DDR_DQ7
DDR_DQ16: U701.G2(DQ6) ; port DDR3L_BL2.DDR_DQ0
DDR_DQ17: U701.H3(DQ4) ; port DDR3L_BL2.DDR_DQ1
DDR_DQ18: U701.F2(DQ2) ; port DDR3L_BL2.DDR_DQ2
DDR_DQ19: U701.E3(DQ0) ; port DDR3L_BL2.DDR_DQ3
DDR_DQ20: U701.H7(DQ7) ; port DDR3L_BL2.DDR_DQ4
DDR_DQ21: U701.H8(DQ5) ; port DDR3L_BL2.DDR_DQ5
DDR_DQ22: U701.F7(DQ1) ; port DDR3L_BL2.DDR_DQ6
DDR_DQ23: U701.F8(DQ4) ; port DDR3L_BL2.DDR_DQ7
DDR_DQ24: U701.C2(DQ11) ; port DDR3L_BL3.DDR_DQ0
DDR_DQ25: U701.C8(DQ10) ; port DDR3L_BL3.DDR_DQ1
DDR_DQ26: U701.A3(DQ15) ; port DDR3L_BL3.DDR_DQ2
DDR_DQ27: U701.B8(DQ14) ; port DDR3L_BL3.DDR_DQ3
DDR_DQ28: U701.C3(DQ9) ; port DDR3L_BL3.DDR_DQ4
DDR_DQ29: U701.A7(DQ12) ; port DDR3L_BL3.DDR_DQ5
DDR_DQ30: U701.A2(DQ13) ; port DDR3L_BL3.DDR_DQ6
DDR_DQ31: U701.D7(DQ8) ; port DDR3L_BL3.DDR_DQ7
DDR_DQS0_N: U700.B7(UDQS#) ; port DDR3L_BL0.DQS_N
DDR_DQS0_P: U700.C7(UDQS) ; port DDR3L_BL0.DQS_P
DDR_DQS1_N: U700.G3(LDQS#) ; port DDR3L_BL1.DQS_N
DDR_DQS1_P: U700.F3(LDQS) ; port DDR3L_BL1.DQS_P
DDR_DQS2_N: U701.G3(LDQS#) ; port DDR3L_BL2.DQS_N
DDR_DQS2_P: U701.F3(LDQS) ; port DDR3L_BL2.DQS_P
DDR_DQS3_N: U701.B7(UDQS#) ; port DDR3L_BL3.DQS_N
DDR_DQS3_P: U701.C7(UDQS) ; port DDR3L_BL3.DQS_P
DDR_DRST_B: U700.T2(RESET#) U701.T2(RESET#) ; port DDR3_ACC.RESET
DDR_ODT: U700.K1(ODT) U701.K1(ODT) ; port DDR3_ACC.ODT
DDR_RAS_B: U700.J3(RAS#) U701.J3(RAS#) ; port DDR3_ACC.RAS
DDR_WE_B: U700.L3(WE#) U701.L3(WE#) ; port DDR3_ACC.WE
DDR_ZQ_1: R700.2 U700.L8(ZQ)
DDR_ZQ_2: R701.2 U701.L8(ZQ)

Not connected (* = marked no-connect by the designer): U700 J1(_NC)* J9(_NC)* L1(_NC)* L9(_NC)* M7(_NC)*; U701 J1(_NC)* J9(_NC)* L1(_NC)* L9(_NC)* M7(_NC)*

### Layout directives
Impedance: S40; net class DDR3_ACC_S40: DDR_A0, DDR_A1, DDR_A2, DDR_A3, DDR_A4, DDR_A5, DDR_A6, DDR_A7, DDR_A8, DDR_A9, DDR_A10, DDR_A11, DDR_A12, DDR_A13, DDR_A14, DDR_BA0, DDR_BA1, DDR_BA2, DDR_CAS_B, DDR_CKE, DDR_CS_B, DDR_DRST_B, DDR_ODT, DDR_RAS_B, DDR_WE_B
differential pair; Impedance: D80; differential pair class DDR_ACC_CLK: DDR_CK_N, DDR_CK_P
net class DDR3_BL1: DDR_DM0, DDR_DQ0, DDR_DQ1, DDR_DQ2, DDR_DQ3, DDR_DQ4, DDR_DQ5, DDR_DQ6, DDR_DQ7, DDR_DQS0_N, DDR_DQS0_P
net class DDR3_BL0: DDR_DM1, DDR_DQ8, DDR_DQ9, DDR_DQ10, DDR_DQ11, DDR_DQ12, DDR_DQ13, DDR_DQ14, DDR_DQ15, DDR_DQS1_N, DDR_DQS1_P
net class DDR3_BL3: DDR_DM2, DDR_DQ16, DDR_DQ17, DDR_DQ18, DDR_DQ19, DDR_DQ20, DDR_DQ21, DDR_DQ22, DDR_DQ23, DDR_DQS2_N, DDR_DQS2_P
net class DDR3_BL2: DDR_DM3, DDR_DQ24, DDR_DQ25, DDR_DQ26, DDR_DQ27, DDR_DQ28, DDR_DQ29, DDR_DQ30, DDR_DQ31, DDR_DQS3_N, DDR_DQS3_P

### Notes on the sheet
- DDR3L IC
- Project Title
- Uğur KELEŞ
- Drawn By
- Sheet Name
- Date
- Sheet
- /
- Sheet Size
- A3
- (in symbol MT41K256M16TW-107 IT:P, part A) DDR3L; MEMORY
- (in symbol MT41K256M16TW-107 IT:P, part B) DDR3L; POWER

### Library data of the parts
C701-C705 C707-C713 C716-C718 C721-C723 C725-C729 C731-C735 C738-C740 C743-C745 = GRM155R71C104KA88J: as C1500 on sheet ZHSD-HDMI; ComponentLink1Description: Datasheet; ComponentLink1URL: https://search.murata.co.jp/Ceramy/image/img/A01X/G101/ENG/GRM155R71C104KA88-01.pdf; MPN: GRM155R71C104KA88J; Package: 0402; Tolerance: ±10%; Voltage: 16V
C714 C719 C736 C741 = GRM188Z71A106MA73D: as C1502 on sheet ZHSD-HDMI; ComponentLink1Description: Datasheet; ComponentLink1URL: https://search.murata.co.jp/Ceramy/image/img/A01X/G101/ENG/GRM188Z71A106MA73-01A.pdf; MPN: GRM188Z71A106MA73D; Package: 0603; Tolerance: ±20%; Voltage: 10V
C715 C720 C737 C742 = GRM155R60J474KE19D: as C600 on sheet ZHSD-ZYNQ-DDR; ComponentLink1Description: Datasheet; ComponentLink1URL: https://search.murata.co.jp/Ceramy/image/img/A01X/G101/ENG/GRM21BR71A475KE51-01.pdf; MPN: GRM155R60J474KE19D; Package: 0402; Tolerance: ±10%; Voltage: 6.3V
R700 R701 = RC0402FR-07240RL: RES 240 OHM 1% 1/16W 0402 (1005); Manufacturer: YAGEO; Value: 240 Ohms; Voltage: 50V; ComponentLink1Description: Datasheet; ComponentLink1URL: https://yageogroup.com/content/datasheet/asset/file/PYU-RC_GROUP_51_ROHS_L; MPN: RC0402FR-07240RL; Tolerance: ±1%; Package: 0402
U700 U701 = MT41K256M16TW-107 IT:P: SDRAM - DDR3L Memory IC 4Gbit Parallel 933 MHz 20 ns 96-FBGA (8x14); Manufacturer: Micron Technology Inc.; MPN: MT41K256M16TW-107 IT:P; ComponentLink1Description: Datasheet; ComponentLink1URL: https://datasheet.octopart.com/MT41K256M16TW-107%3AP-Micron-datasheet-149527670.pdf

## Sheet ZHSD-POWER.SchDoc
size A3; DocumentNumber: 1; SheetNumber: 2; SheetTotal: 17; Size: A3
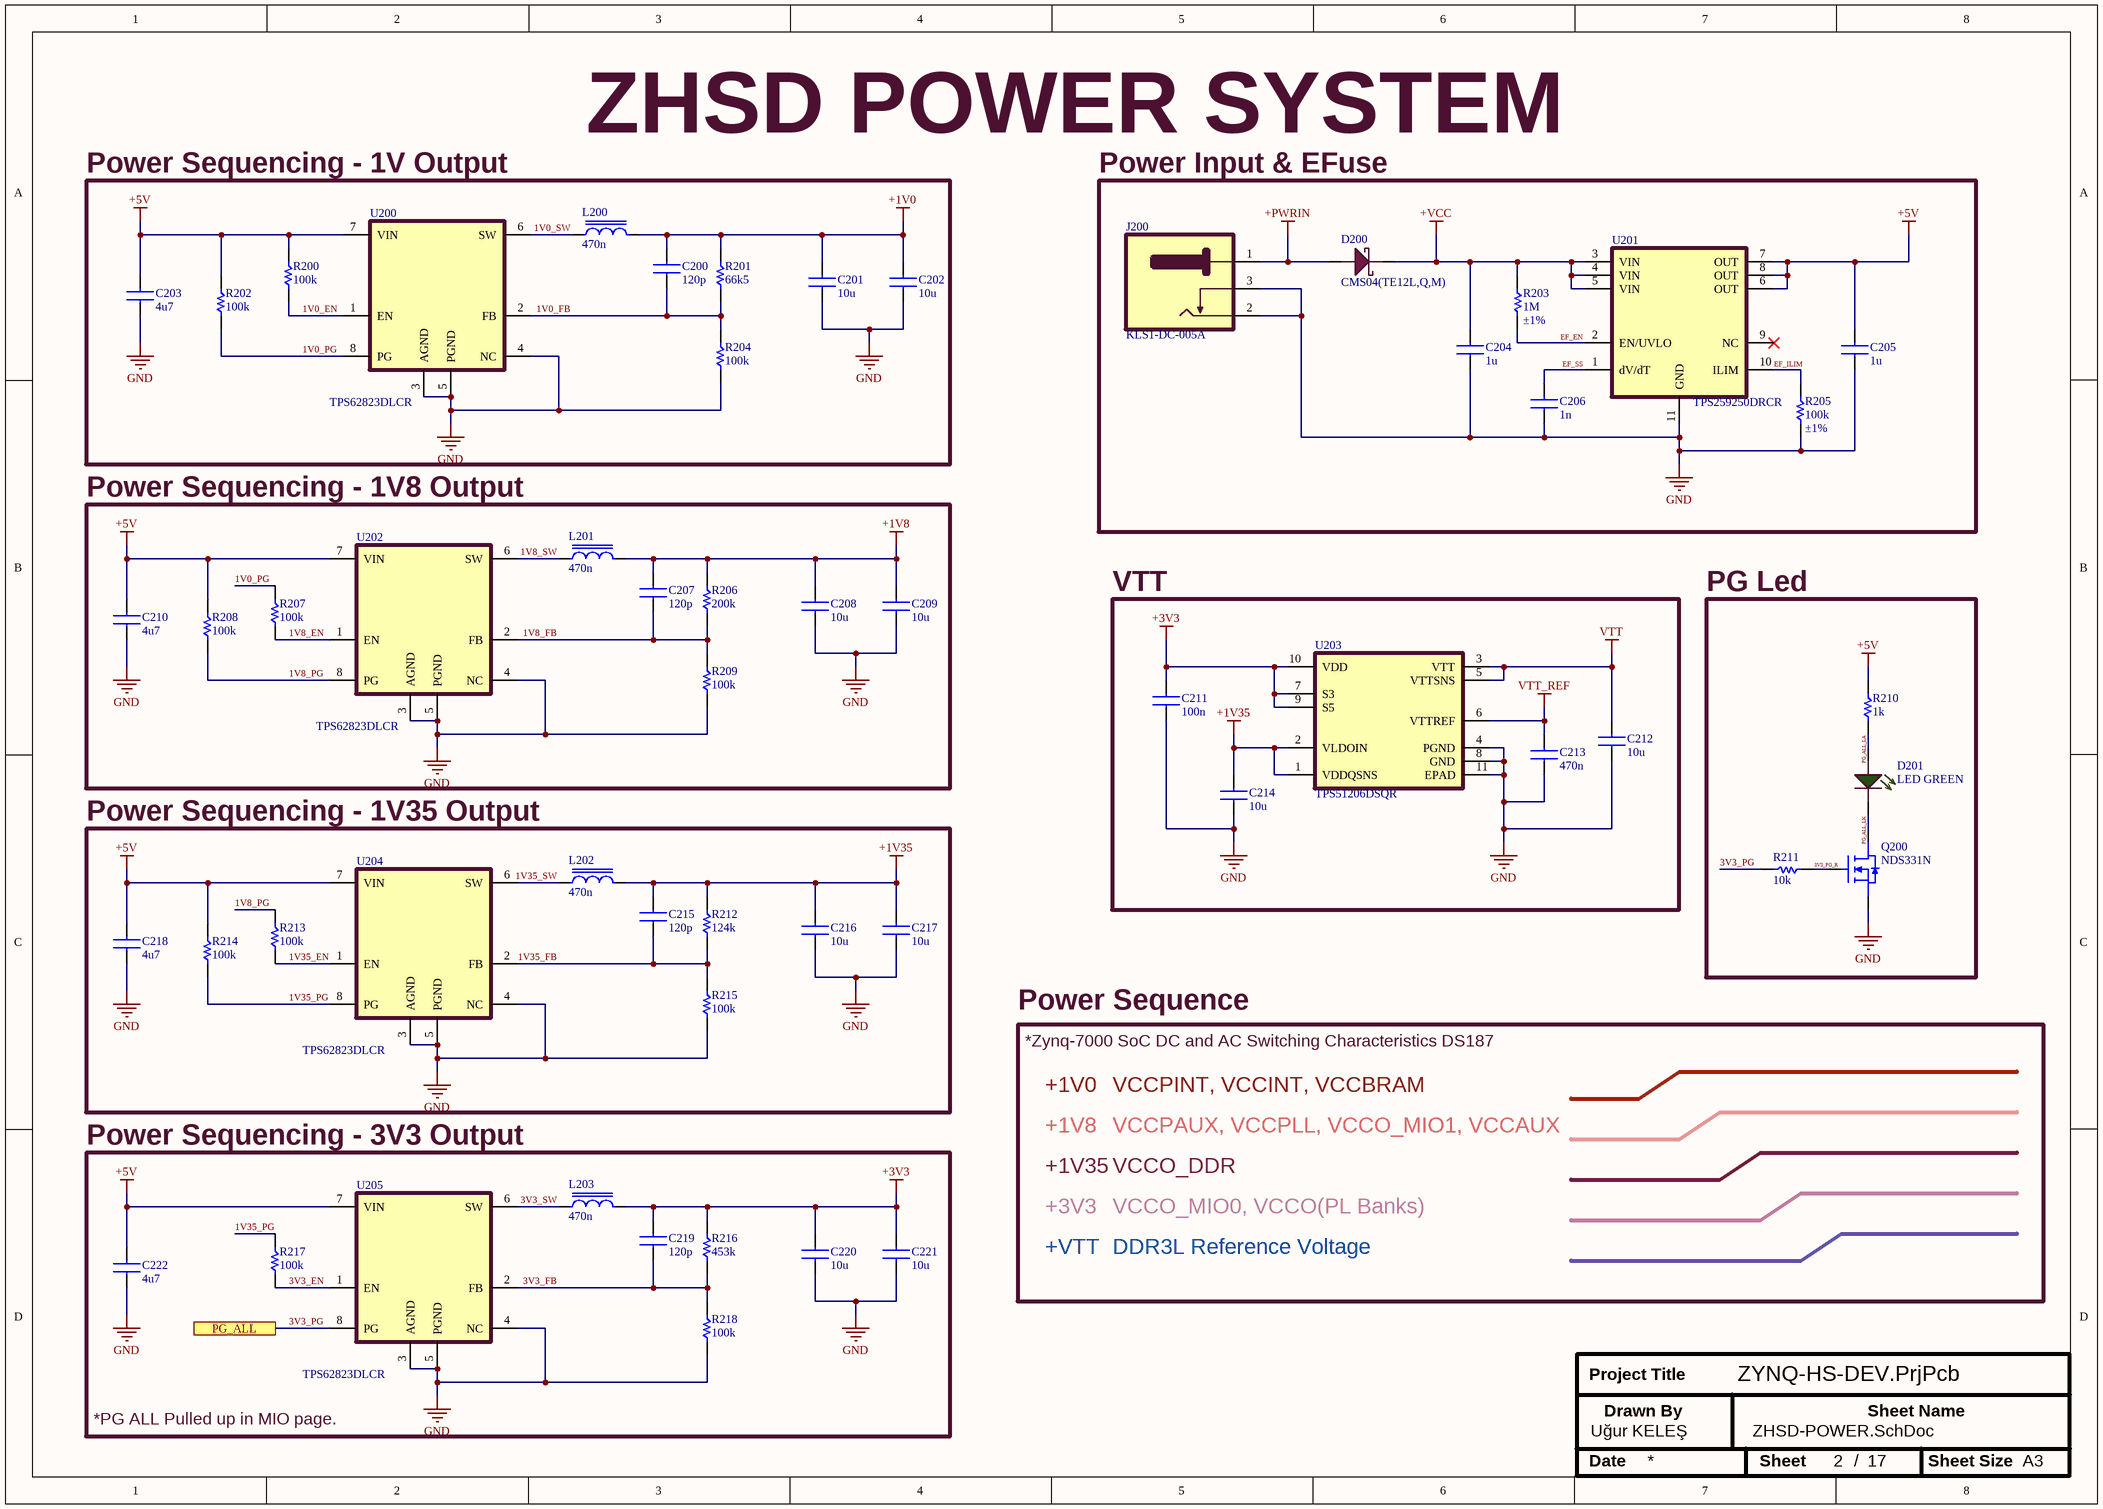
[diagram p15: ZHSD-POWER.SchDoc]

### Parts
C200  120p  [0603CAPC1608X09N]
C201  10u  [0603CAPC1608X09N]
C202  10u  [0603CAPC1608X09N]
C203  4u7  [0805CAPC2012X14N]
C204  1u  [0603CAPC1608X09N]
C205  1u  [0603CAPC1608X09N]
C206  1n  [0603CAPC1608X09N]
C207  120p  [0603CAPC1608X09N]
C208  10u  [0603CAPC1608X09N]
C209  10u  [0603CAPC1608X09N]
C210  4u7  [0805CAPC2012X14N]
C211  100n  [0402CAPC1005X06N]
C212  10u  [0603CAPC1608X09N]
C213  470n  [0402CAPC1005X06N]
C214  10u  [0603CAPC1608X09N]
C215  120p  [0603CAPC1608X09N]
C216  10u  [0603CAPC1608X09N]
C217  10u  [0603CAPC1608X09N]
C218  4u7  [0805CAPC2012X14N]
C219  120p  [0603CAPC1608X09N]
C220  10u  [0603CAPC1608X09N]
C221  10u  [0603CAPC1608X09N]
C222  4u7  [0805CAPC2012X14N]
D200  CMS04(TE12L,Q,M)  [SOD-128]
D201  LED GREEN  [0603_LED_1608N]
J200  KLS1-DC-005A  [CONN-KLS1-DC-005A]
L200  470n  [0806INDC2016X10N]
L201  470n  [0806INDC2016X10N]
L202  470n  [0806INDC2016X10N]
L203  470n  [0806INDC2016X10N]
Q200  NDS331N  [SOT95P251X112-3N]
R200  100k  [0603RESC1608X05L]
R201  66k5  [0603RESC1608X05N]
R202  100k  [0603RESC1608X05L]
R203  1M  Tolerance: ±1%  [0603RESC1608X05N]
R204  100k  [0603RESC1608X05L]
R205  100k  Tolerance: ±1%  [0603RESC1608X05L]
R206  200k  [0603RESC1608X05N]
R207  100k  [0603RESC1608X05L]
R208  100k  [0603RESC1608X05L]
R209  100k  [0603RESC1608X05L]
R210  1k  [0402RESC1005X04N]
R211  10k  [0603RESC1608X05N]
R212  124k  [0603RESC1608X05N]
R213  100k  [0603RESC1608X05L]
R214  100k  [0603RESC1608X05L]
R215  100k  [0603RESC1608X05L]
R216  453k  [0603RESC1608X05N]
R217  100k  [0603RESC1608X05L]
R218  100k  [0603RESC1608X05L]
U200  TPS62823DLCR  [VSON50P150X100-8N]
U201  TPS259250DRCR  [VSON50P300X100_HS-11N]
U202  TPS62823DLCR  [VSON50P150X100-8N]
U203  TPS51206DSQR  [WSON2X2-10/SON40P200X80_HS-11N]
U204  TPS62823DLCR  [VSON50P150X100-8N]
U205  TPS62823DLCR  [VSON50P150X100-8N]

### Blocks framed on the sheet
Power Sequencing - 1V Output: C200-C203 L200 R200-R202 R204 U200
Power Input & EFuse: C204-C206 D200 J200 R203 R205 U201
Power Sequencing - 1V8 Output: C207-C210 L201 R206-R209 U202
VTT: C211-C214 U203
PG Led: D201 Q200 R210 R211
Power Sequencing - 1V35 Output: C215-C218 L202 R212-R215 U204
Power Sequencing - 3V3 Output: C219-C222 L203 R216-R218 U205

### Ports
PG_ALL (see ZHSD-Block[2100,5600], ZHSD-ZYNQ-MIO[11100,8200])

### Nets
+1V0: C200.2 C201.2 C202.2 L200.2 R201.2
+1V8: C207.2 C208.2 C209.2 L201.2 R206.2
+1V35: C214.2 C215.2 C216.2 C217.2 L202.2 R212.2 U203.1(VDDQSNS) U203.2(VLDOIN)
+3V3: C211.2 C219.2 C220.2 C221.2 L203.2 R216.2 U203.7(S3) U203.9(S5) U203.10(VDD)
+5V: C203.2 C205.2 C210.2 C218.2 C222.2 R200.2 R202.2 R208.2 R210.2 R214.2 U200.7(VIN) U201.6(OUT) U201.7(OUT) U201.8(OUT) U202.7(VIN) U204.7(VIN) U205.7(VIN)
+PWRIN: D200.A J200.1(VCC)
+VCC: C204.2 D200.C R203.1 U201.3(VIN) U201.4(VIN) U201.5(VIN)
GND: C201.1 C202.1 C203.1 C204.1 C205.1 C206.1 C208.1 C209.1 C210.1 C211.1 C212.1 C213.1 C214.1 C216.1 C217.1 C218.1 C220.1 C221.1 C222.1 J200.2(GND) J200.3(SH) Q200.2(S) R204.1 R205.1 R209.1 R215.1 R218.1 U200.3(AGND) U200.4(NC) U200.5(PGND) U201.11(GND) U202.3(AGND) U202.4(NC) U202.5(PGND) U203.4(PGND) U203.8(GND) U203.11(EPAD) U204.3(AGND) U204.4(NC) U204.5(PGND) U205.3(AGND) U205.4(NC) U205.5(PGND)
VTT: C212.2 U203.3(VTT) U203.5(VTTSNS)
VTT_REF: C213.2 U203.6(VTTREF)
1V0_EN: R200.1 U200.1(EN)
1V0_FB: C200.1 R201.1 R204.2 U200.2(FB)
1V0_PG: R202.1 R207.2 U200.8(PG)
1V0_SW: L200.1 U200.6(SW)
1V8_EN: R207.1 U202.1(EN)
1V8_FB: C207.1 R206.1 R209.2 U202.2(FB)
1V8_PG: R208.1 R213.2 U202.8(PG)
1V8_SW: L201.1 U202.6(SW)
1V35_EN: R213.1 U204.1(EN)
1V35_FB: C215.1 R212.1 R215.2 U204.2(FB)
1V35_PG: R214.1 R217.2 U204.8(PG)
1V35_SW: L202.1 U204.6(SW)
3V3_EN: R217.1 U205.1(EN)
3V3_FB: C219.1 R216.1 R218.2 U205.2(FB)
3V3_PG: R211.2 U205.8(PG) ; port PG_ALL
3V3_PG_R: Q200.1(G) R211.1
3V3_SW: L203.1 U205.6(SW)
EF_EN: R203.2 U201.2(EN/UVLO)
EF_ILIM: R205.2 U201.10(ILIM)
EF_SS: C206.2 U201.1(dV/dT)
PG_ALL_LA: D201.1(A) R210.1
PG_ALL_LK: D201.2(C) Q200.3(D)

Not connected (* = marked no-connect by the designer): U201 9(NC)*

### Notes on the sheet
- ZHSD POWER SYSTEM
- Power Sequence
- *Zynq-7000 SoC DC and AC Switching Characteristics DS187
- +1V0
- VCCPINT, VCCINT, VCCBRAM
- +1V8
- +1V35
- VCCPAUX, VCCPLL, VCCO_MIO1, VCCAUX
- VCCO_DDR
- +3V3
- +VTT
- VCCO_MIO0, VCCO(PL Banks)
- DDR3L Reference Voltage
- *PG ALL Pulled up in MIO page.
- Project Title
- Uğur KELEŞ
- Drawn By
- Sheet Name
- Date
- Sheet
- /
- Sheet Size
- A3

### Library data of the parts
C200 C207 C215 C219 = GRM1885C1H121JA01D: CAP CER 120PF 50V C0G/NP0 0603 (1608) ±5%; Manufacturer: Murata Electronics; ComponentLink1Description: Datasheet; ComponentLink1URL: https://search.murata.co.jp/Ceramy/image/img/A01X/G101/ENG/GRM1885C1H121JA01-01.pdf; MPN: GRM1885C1H121JA01D; Package: 0603; Tolerance: ±5%; Value: 120 pF; Voltage: 50V
C201 C202 C208 C209 C212 C214 C216 C217 C220 C221 = GRM188Z71A106MA73D: as C1502 on sheet ZHSD-HDMI; ComponentLink1Description: Datasheet; ComponentLink1URL: https://search.murata.co.jp/Ceramy/image/img/A01X/G101/ENG/GRM188Z71A106MA73-01A.pdf; MPN: GRM188Z71A106MA73D; Package: 0603; Tolerance: ±20%; Voltage: 10V
C203 C210 C218 C222 = GRM21BR71A475KE51L: CAP CER 4.7UF 10V X7R 0805 (2012) ±10%; Manufacturer: Murata Electronics; Value: 4.7 µF; ComponentLink1Description: Datasheet; ComponentLink1URL: https://search.murata.co.jp/Ceramy/image/img/A01X/G101/ENG/GRM21BR71A475KE51-01.pdf; MPN: GRM21BR71A475KE51L; Package: 0805; Tolerance: ±10%; Voltage: 10V
C204 C205 = GRM188R61E105KA12D: as C1518 on sheet ZHSD-HDMI; ComponentLink1Description: Datasheet; ComponentLink1URL: https://search.murata.co.jp/Ceramy/image/img/A01X/G101/ENG/GRM188R61E105KA12-01.pdf; MPN: GRM188R61E105KA12D; Package: 0603; Tolerance: ±10%; Voltage: 25V
C206 = GCM188R71H102KA37D: CAP CER 1000PF 50V X7R 0603 (1608) ±10%; Manufacturer: Murata Electronics; ComponentLink1Description: Datasheet; ComponentLink1URL: https://search.murata.co.jp/Ceramy/image/img/A01X/G101/ENG/GCM188R71H102KA37-01.pdf; MPN: GCM188R71H102KA37D; Package: 0603; Tolerance: ±10%; Value: 1000 pF; Voltage: 50V
C211 = GRM155R71C104KA88J: as C1500 on sheet ZHSD-HDMI; ComponentLink1Description: Datasheet; ComponentLink1URL: https://search.murata.co.jp/Ceramy/image/img/A01X/G101/ENG/GRM155R71C104KA88-01.pdf; MPN: GRM155R71C104KA88J; Package: 0402; Tolerance: ±10%; Voltage: 16V
C213 = GRM155R60J474KE19D: as C600 on sheet ZHSD-ZYNQ-DDR; ComponentLink1Description: Datasheet; ComponentLink1URL: https://search.murata.co.jp/Ceramy/image/img/A01X/G101/ENG/GRM21BR71A475KE51-01.pdf; MPN: GRM155R60J474KE19D; Package: 0402; Tolerance: ±10%; Voltage: 6.3V
D200 = CMS04: Diode 30 V 5A Surface Mount M-FLAT (2.4x3.8); Manufacturer: Toshiba Semiconductor and Storage; ComponentLink1Description: Datasheet; ComponentLink1URL: https://toshiba.semicon-storage.com/info/CMS04_datasheet_en_20180911.pdf?did=3133&prodName=CMS04; MPN: CMS04(TE12L,Q; Package: SOD-123
D201 = LTST-C191TGKT: as D1400-D1402 on sheet ZHSD-ZYNQ-PL; ComponentLink1Description: Datasheet; ComponentLink1URL: https://optoelectronics.liteon.com/upload/download/DS22-2000-300/LTST-C191TGKT.PDF; MPN: LTST-C191TGKT; Package: 0603
J200 = KLS1-DC-005A: CONNECTOR DC JACK POWER PCB TYPE 2.50MM KLS; Manufacturer: KLS ELECTRONIC; MPN: L-KLS1-DC-005A-2.0; ComponentLink1Description: Datasheet; ComponentLink1URL: https://www.ozdisan.com/api/pdf/product/assets/KLS1-DC-005A.pdf
L200-L203 = DFE201610E-R47M=P2: FIXED IND 470NH 3.6A 32 MOHM SMD 0806 (2016 Metric); Manufacturer: Murata Electronics; DC Resistance (DCR) (Max): 32mOhm; Current - Saturation (Isat): 4.8A; ComponentLink1Description: Datasheet; ComponentLink1URL: https://pim.murata.com/asset/pim4/inductor/J(E)TE243A-0001_PDF_INDUCTOR?lastModifiedDatetime=20250708072022; ComponentLink2Description: Website; ComponentLink2URL: https://pim.murata.com/en-global/pim/details/?partNum=DFE201610E-R47M%23; Current Rating (Max): 3.6 A; Inductance: 470 nH; MPN: DFE201610E-R47M=P2; Package: 0806
Q200 = NDS331N: N-Channel 20 V 1.3A (Ta) 500mW (Ta) Surface Mount SOT-23-3; Manufacturer: onsemi; Drain to Source Voltage (Vdss): 20 V; Rds On (Max) @ Id, Vgs: 160mOhm @ 1.5A, 4.5V; Vgs (Max): ±8V; ComponentLink1Description: Datasheet; ComponentLink1URL: https://www.onsemi.com/pdf/datasheet/nds331n-d.pdf; MPN: NDS331N; Package: SOT-23-3
R200 R202 R204 R205 R207-R209 R213-R215 R217 R218 = CRCW0603100KFKEA: RES SMD 100K OHM 1% 1/8W 0603 (1608); Manufacturer: Vishay Dale; Value: 100 kOhms; Voltage: 75V; ComponentLink1Description: Datasheet; ComponentLink1URL: https://www.vishay.com/docs/20035/dcrcwe3.pdf; MPN: CRCW0603100KFKEA; Package: 0603
  R200 R202 R204 R207-R209 R213-R215 R217 R218: Tolerance: ±1%
R201 = CRCW060366K5FKEA: RES SMD 66.5K OHM 1% 1/8W 0603 (1608); Manufacturer: Vishay Dale; Value: 66.5 kOhms; Voltage: 75V; ComponentLink1Description: Datasheet; ComponentLink1URL: https://www.vishay.com/docs/20035/dcrcwe3.pdf; MPN: CRCW060366K5FKEA; Tolerance: ±1%; Package: 0603
R203 = CRCW06031M00FKEA: RES SMD 1M OHM 1% 1/8W 0603 (1608); Manufacturer: Vishay Dale; Value: 1 MOhms; Voltage: 75V; ComponentLink1Description: Datasheet; ComponentLink1URL: https://www.vishay.com/docs/20035/dcrcwe3.pdf; MPN: CRCW06031M00FKEA; Package: 0603
R206 = CRCW0603200KFKEBC: RES 200K OHM 1% 1/10W 0603 (1608); Manufacturer: Vishay Dale; Value: 200 kOhms; Voltage: 75V; ComponentLink1Description: Datasheet; ComponentLink1URL: https://www.vishay.com/docs/28773/crcwce3.pdf; MPN: CRCW0603200KFKEBC; Tolerance: ±1%; Package: 0603
R210 = RC0402JR-071KL: as R1400-R1402 on sheet ZHSD-ZYNQ-PL; ComponentLink1Description: Datasheet; ComponentLink1URL: https://yageogroup.com/content/datasheet/asset/file/PYU-RT_1-TO-0-01_ROHS_L; MPN: RC0402JR-071KL; Tolerance: ±5%; Package: 0402
R211 = RC0603FR-0710KL: as R1403-R1406 on sheet ZHSD-ZYNQ-PL; ComponentLink1Description: Datasheet; ComponentLink1URL: https://yageogroup.com/content/datasheet/asset/file/PYU-RC_GROUP_51_ROHS_L; MPN: RC0603FR-0710KL; Tolerance: ±1%; Package: 0603
R212 = CRCW0603124KFKEA: RES SMD 124K OHM 1% 1/8W 0603 (1608); Manufacturer: Vishay Dale; Value: 124 kOhms; Voltage: 75V; ComponentLink1Description: Datasheet; ComponentLink1URL: https://www.vishay.com/docs/20035/dcrcwe3.pdf; MPN: CRCW0603124KFKEA; Tolerance: ±1%; Package: 0603
R216 = CRCW0603453KFKEAC: RES 453K OHM 1% 1/10W 0603(1608); Manufacturer: Vishay Dale; Value: 453 kOhms; Voltage: 75V; ComponentLink1Description: Datasheet; ComponentLink1URL: https://www.vishay.com/docs/28773/crcwce3.pdf; MPN: CRCW0603453KFKEAC; Tolerance: ±1%; Package: 0603
U200 U202 U204 U205 = TPS62823DLCR: 2.4-V to 5.5-V input, 3-A step-down converter with 1% accuracy in 1.5-mm x 2-mm VSON-HR package; Manufacturer: Texas Instruments; ComponentLink1Description: Datasheet; ComponentLink1URL: https://www.ti.com/lit/ds/symlink/tps62823.pdf; ComponentLink2Description: Evaluation Module; ComponentLink2URL: https://www.ti.com/lit/ug/slvuba0/slvuba0.pdf; MPN: TPS62823DLCR
U201 = TPS259250DRCR: Electronic Fuse Regulator 5A 10-VSON (3x3); Manufacturer: Texas Instruments; ComponentLink1Description: Datasheet; ComponentLink1URL: https://www.ti.com/lit/ds/symlink/tps25925.pdf?HQS=dis-dk-null-digikeymode-dsf-pf-null-wwe&ts=1768606527240&ref_url=https%253A%252F%252Fwww.ti.com%252Fgeneral%252Fdocs%252Fsuppproductinfo.tsp%253FdistId%253D10%2526gotoUrl%253Dhttps%253A%252F%252Fwww.ti.com%252Flit%252Fgpn%252Ftps25925; ComponentLink2Description: Evaluation Module; ComponentLink2URL: https://www.ti.com/lit/ug/sluub64/sluub64.pdf?ts=1768615249837; MPN: TPS259250DRCR
U203 = TPS51206: Converter, DDR Voltage Regulator IC 1 Output 10-WSON (2x2); Manufacturer: Texas Instruments; ComponentLink1Description: Datasheet; ComponentLink1URL: https://www.ti.com/lit/ds/symlink/tps51206.pdf?HQS=dis-dk-null-digikeymode-dsf-pf-null-wwe&ts=1769211972272&ref_url=https%253A%252F%252Fwww.ti.com%252Fgeneral%252Fdocs%252Fsuppproductinfo.tsp%253FdistId%253D10%2526gotoUrl%253Dhttps%253A%252F%252Fwww.ti.com%252Flit%252Fgpn%252Ftps51206; MPN: TPS51206DSQR; Package: 10-WSON